# EasyEDA Pro project Generic_Robot_Controller_ver1.epro

# Schematic Schematic1_1

## Sheets
1 Block Diagram: Board Name: Board1_1; Create Date: 2024-12-06; Page Name: Block Diagram; Project Name: Generic_Robot_Controller; Schematic Name: Schematic1_1; Update Date: 2024-12-05; Company: EasyEDA.com; Drawn: EasyEDA; Page Size: A4; Part Number: JLCPCB-002; Reviewed: EasyEDA; Version: V0.1
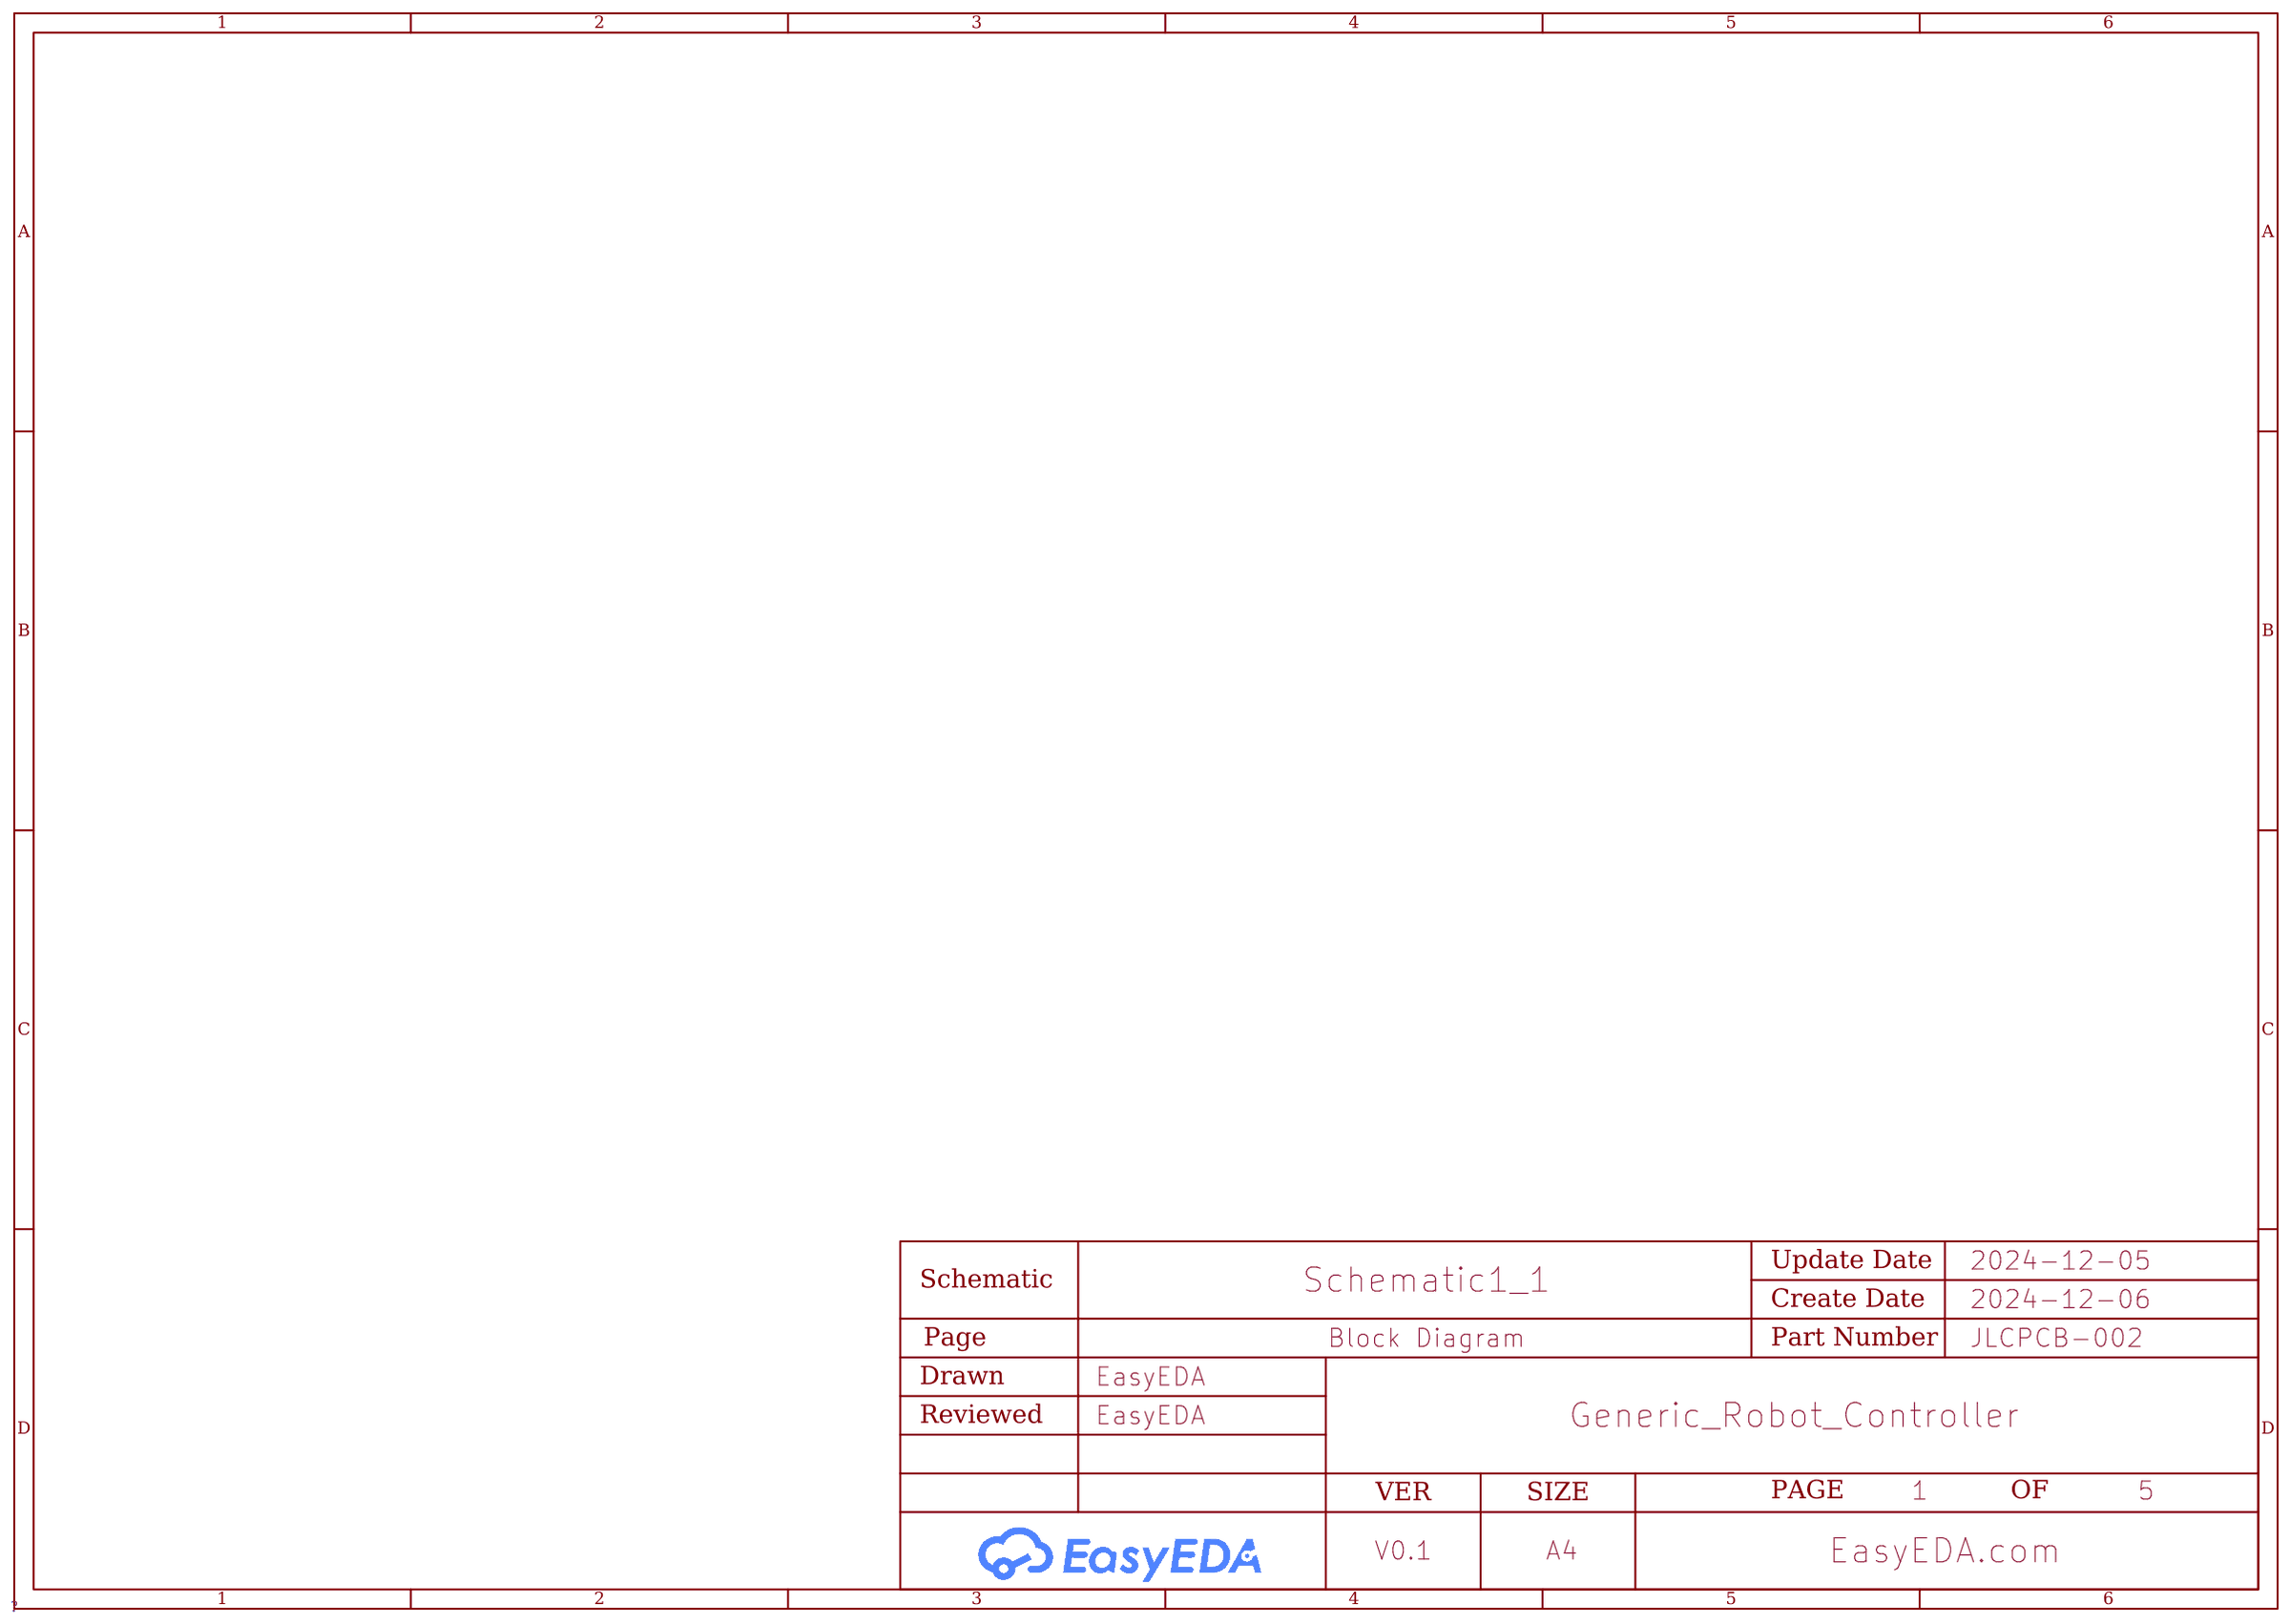
[diagram p0: Block Diagram]
2 MCU Connections: Create Date: 2024-12-05; Page Name: MCU Connections; Update Date: 2024-12-06
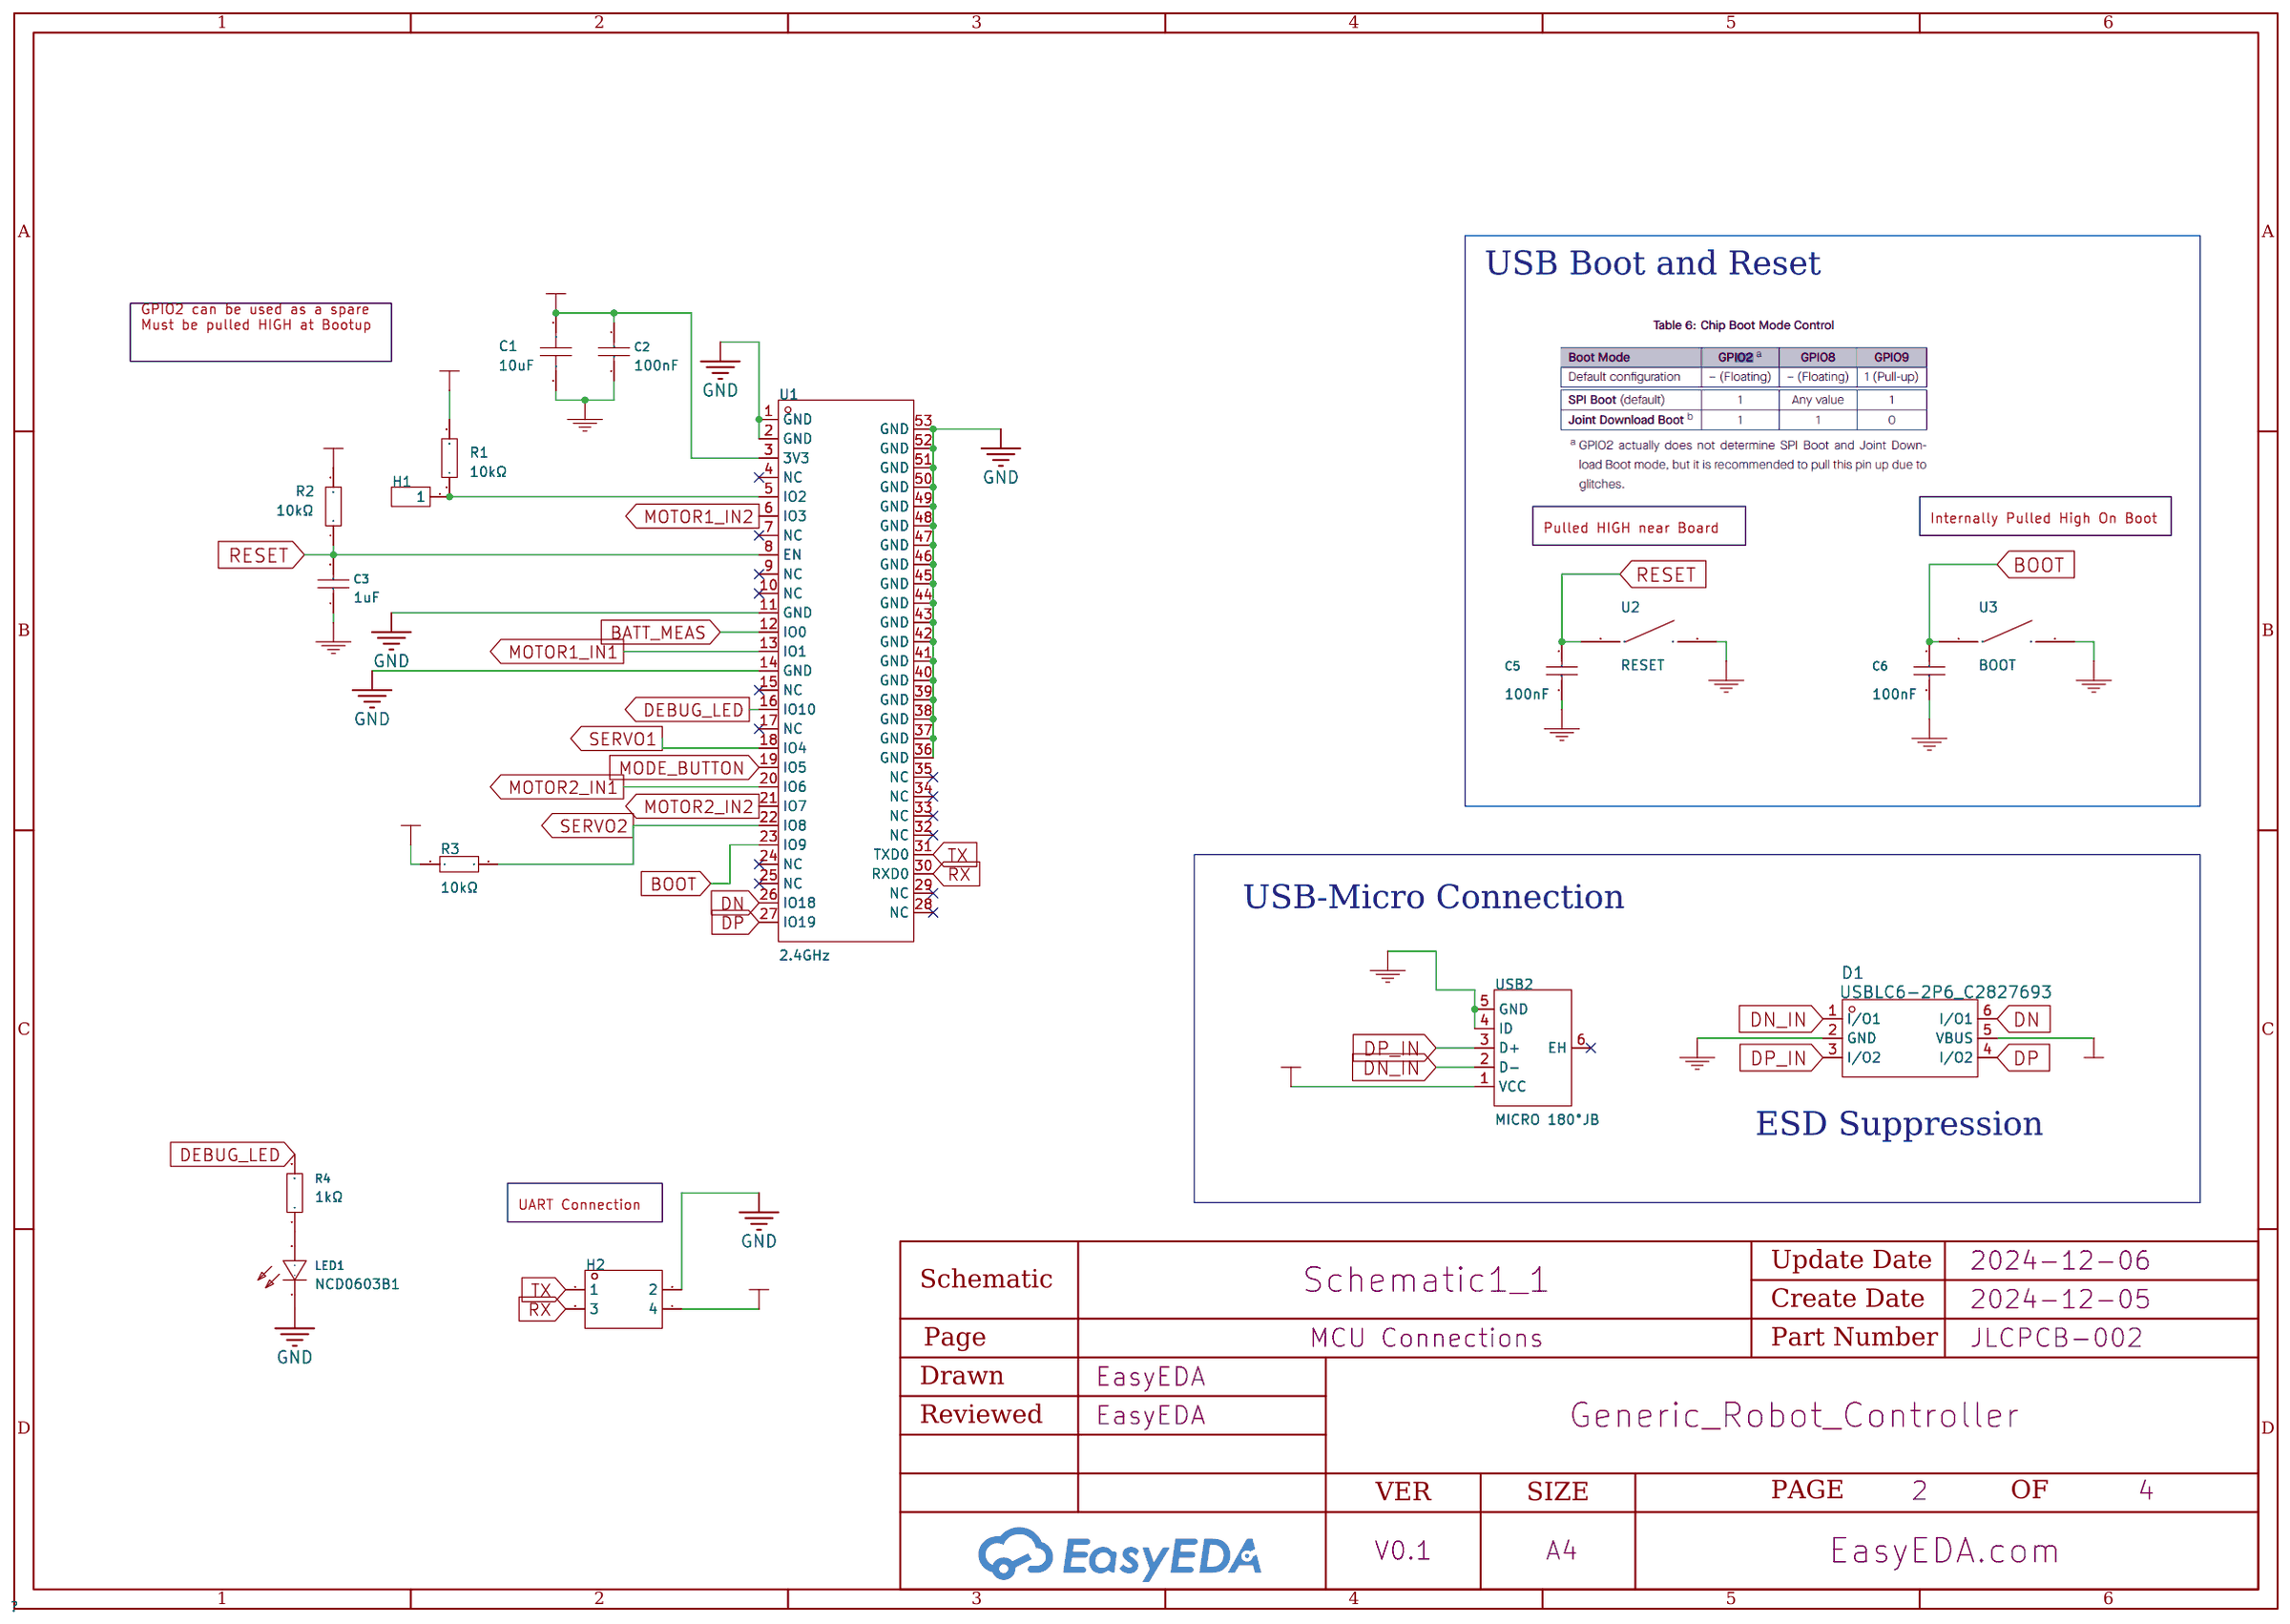
[diagram p1: MCU Connections]
3 Peripherals: Create Date: 2024-12-05; Page Name: Peripherals; Update Date: 2024-12-06
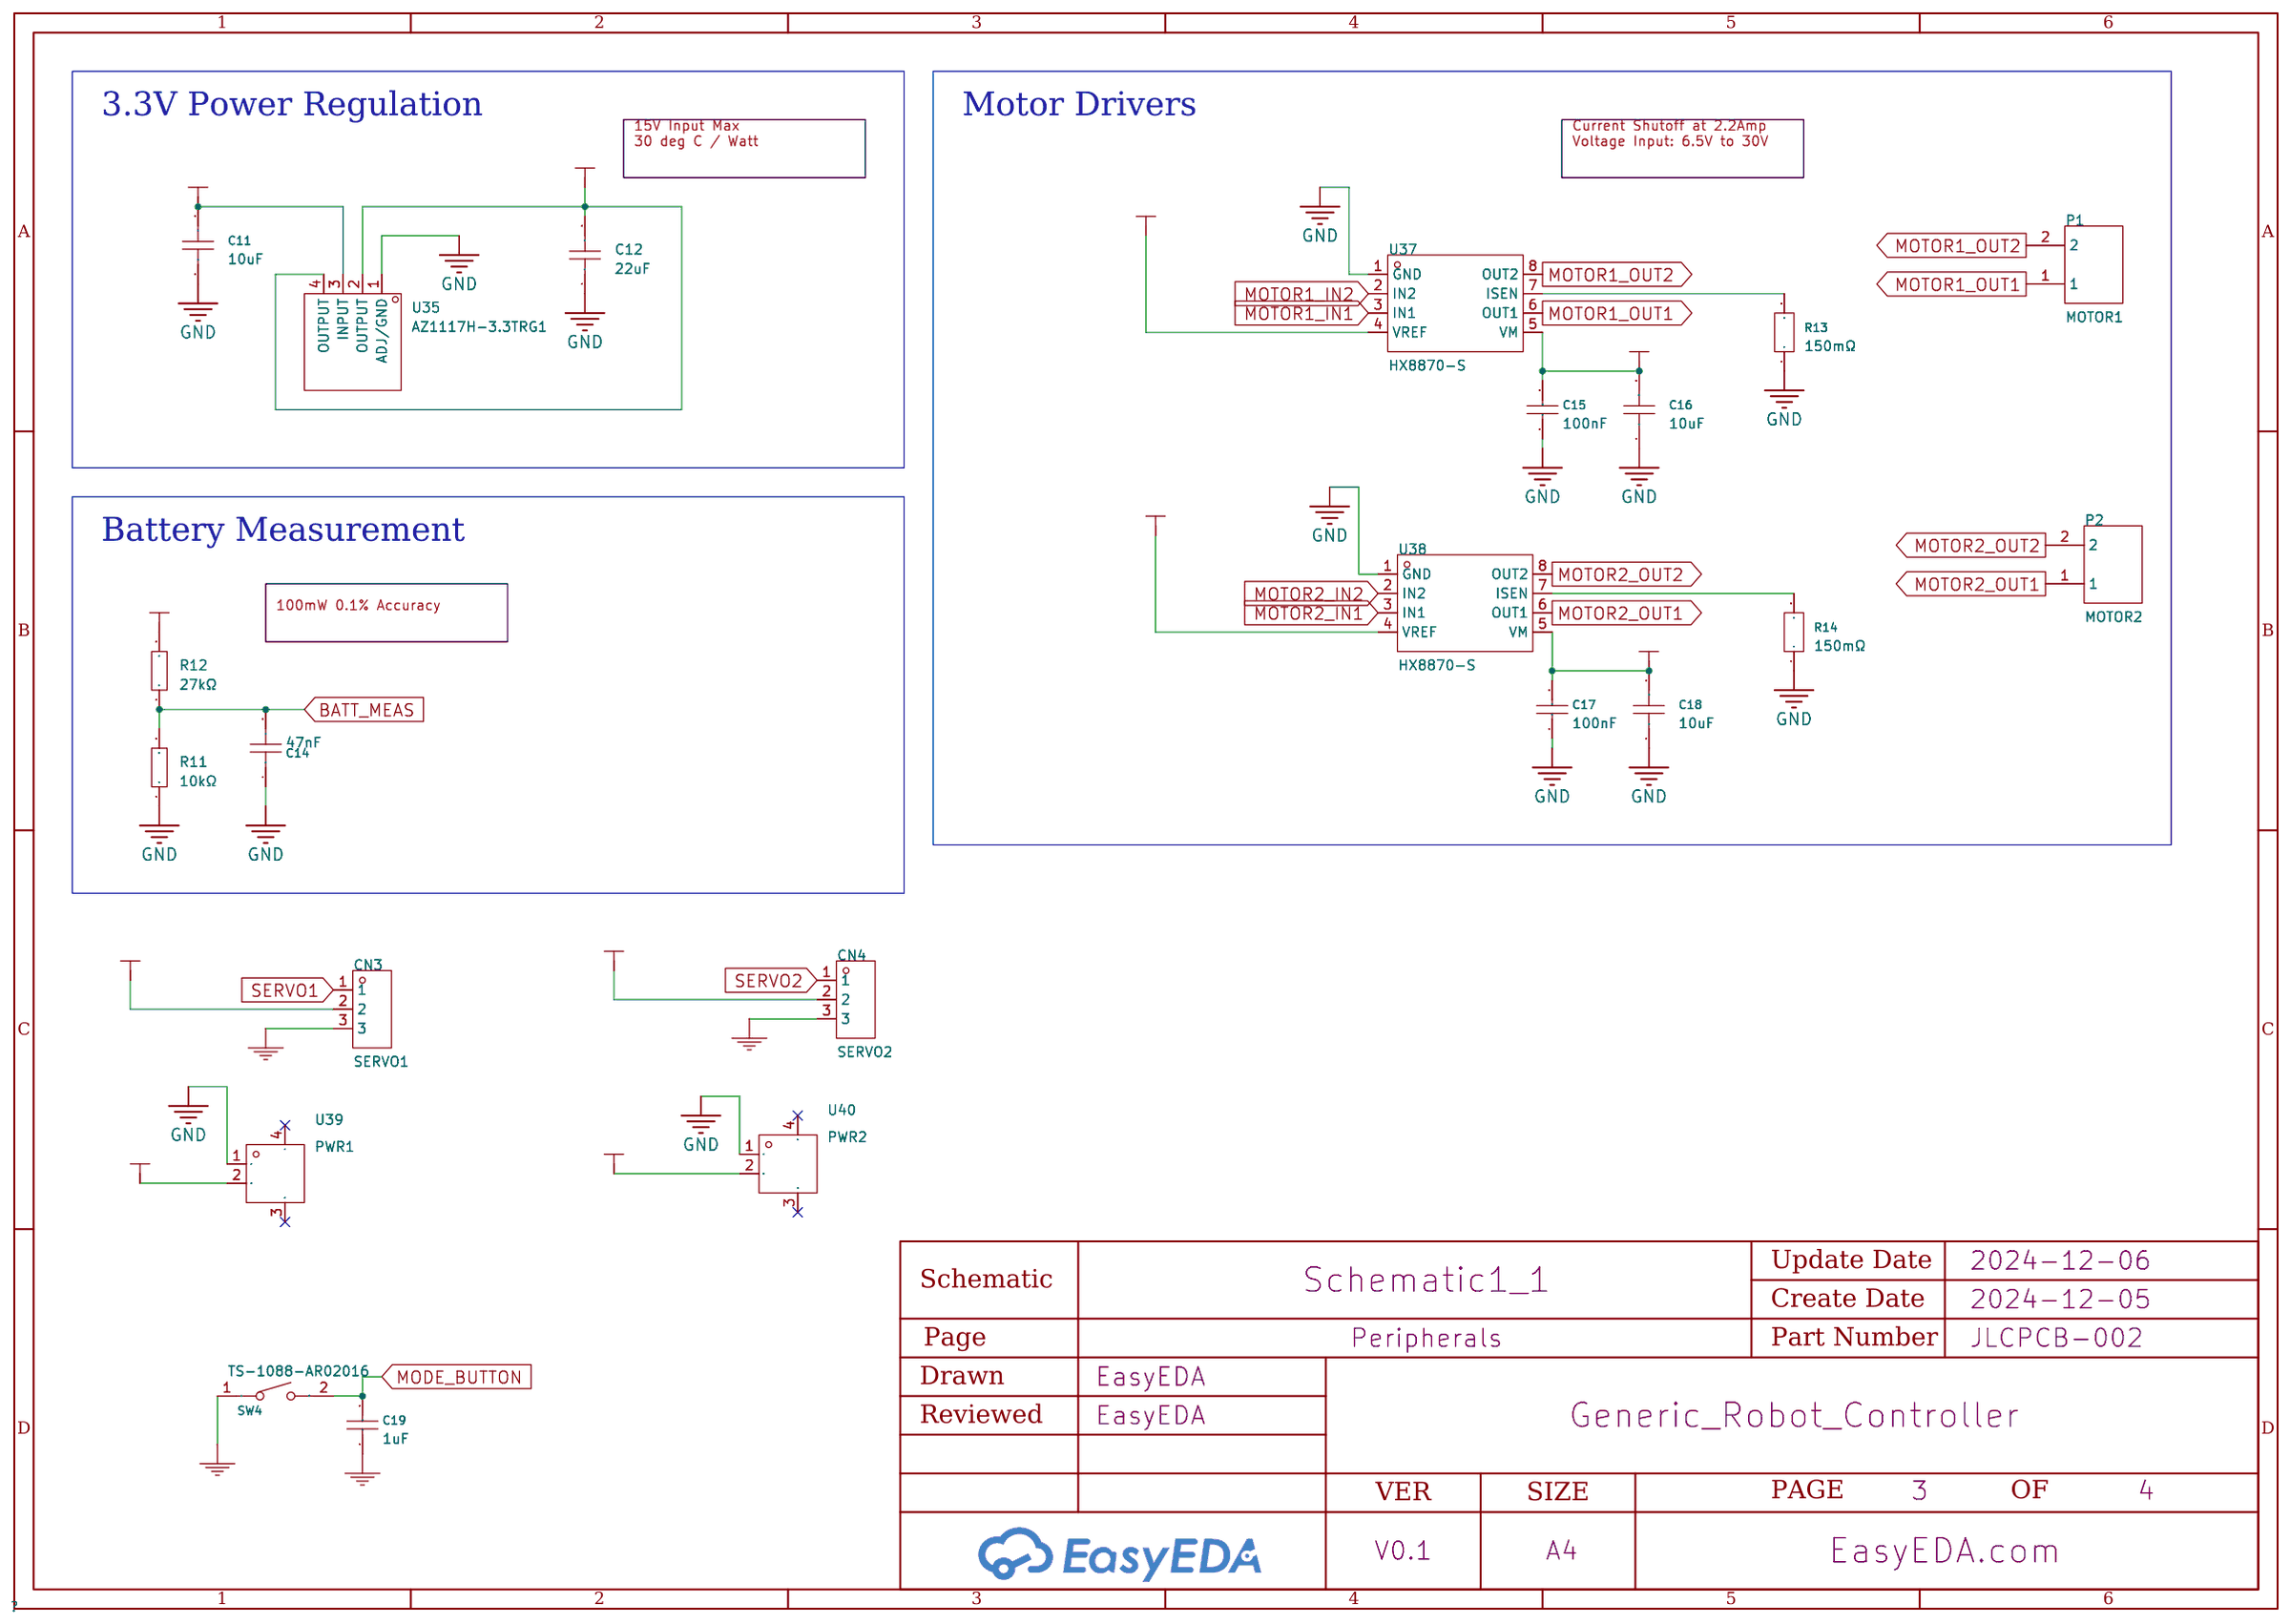
[diagram p2: Peripherals]
4 Power Input and Protection: Page Name: Power Input and Protection; Update Date: 2024-12-06
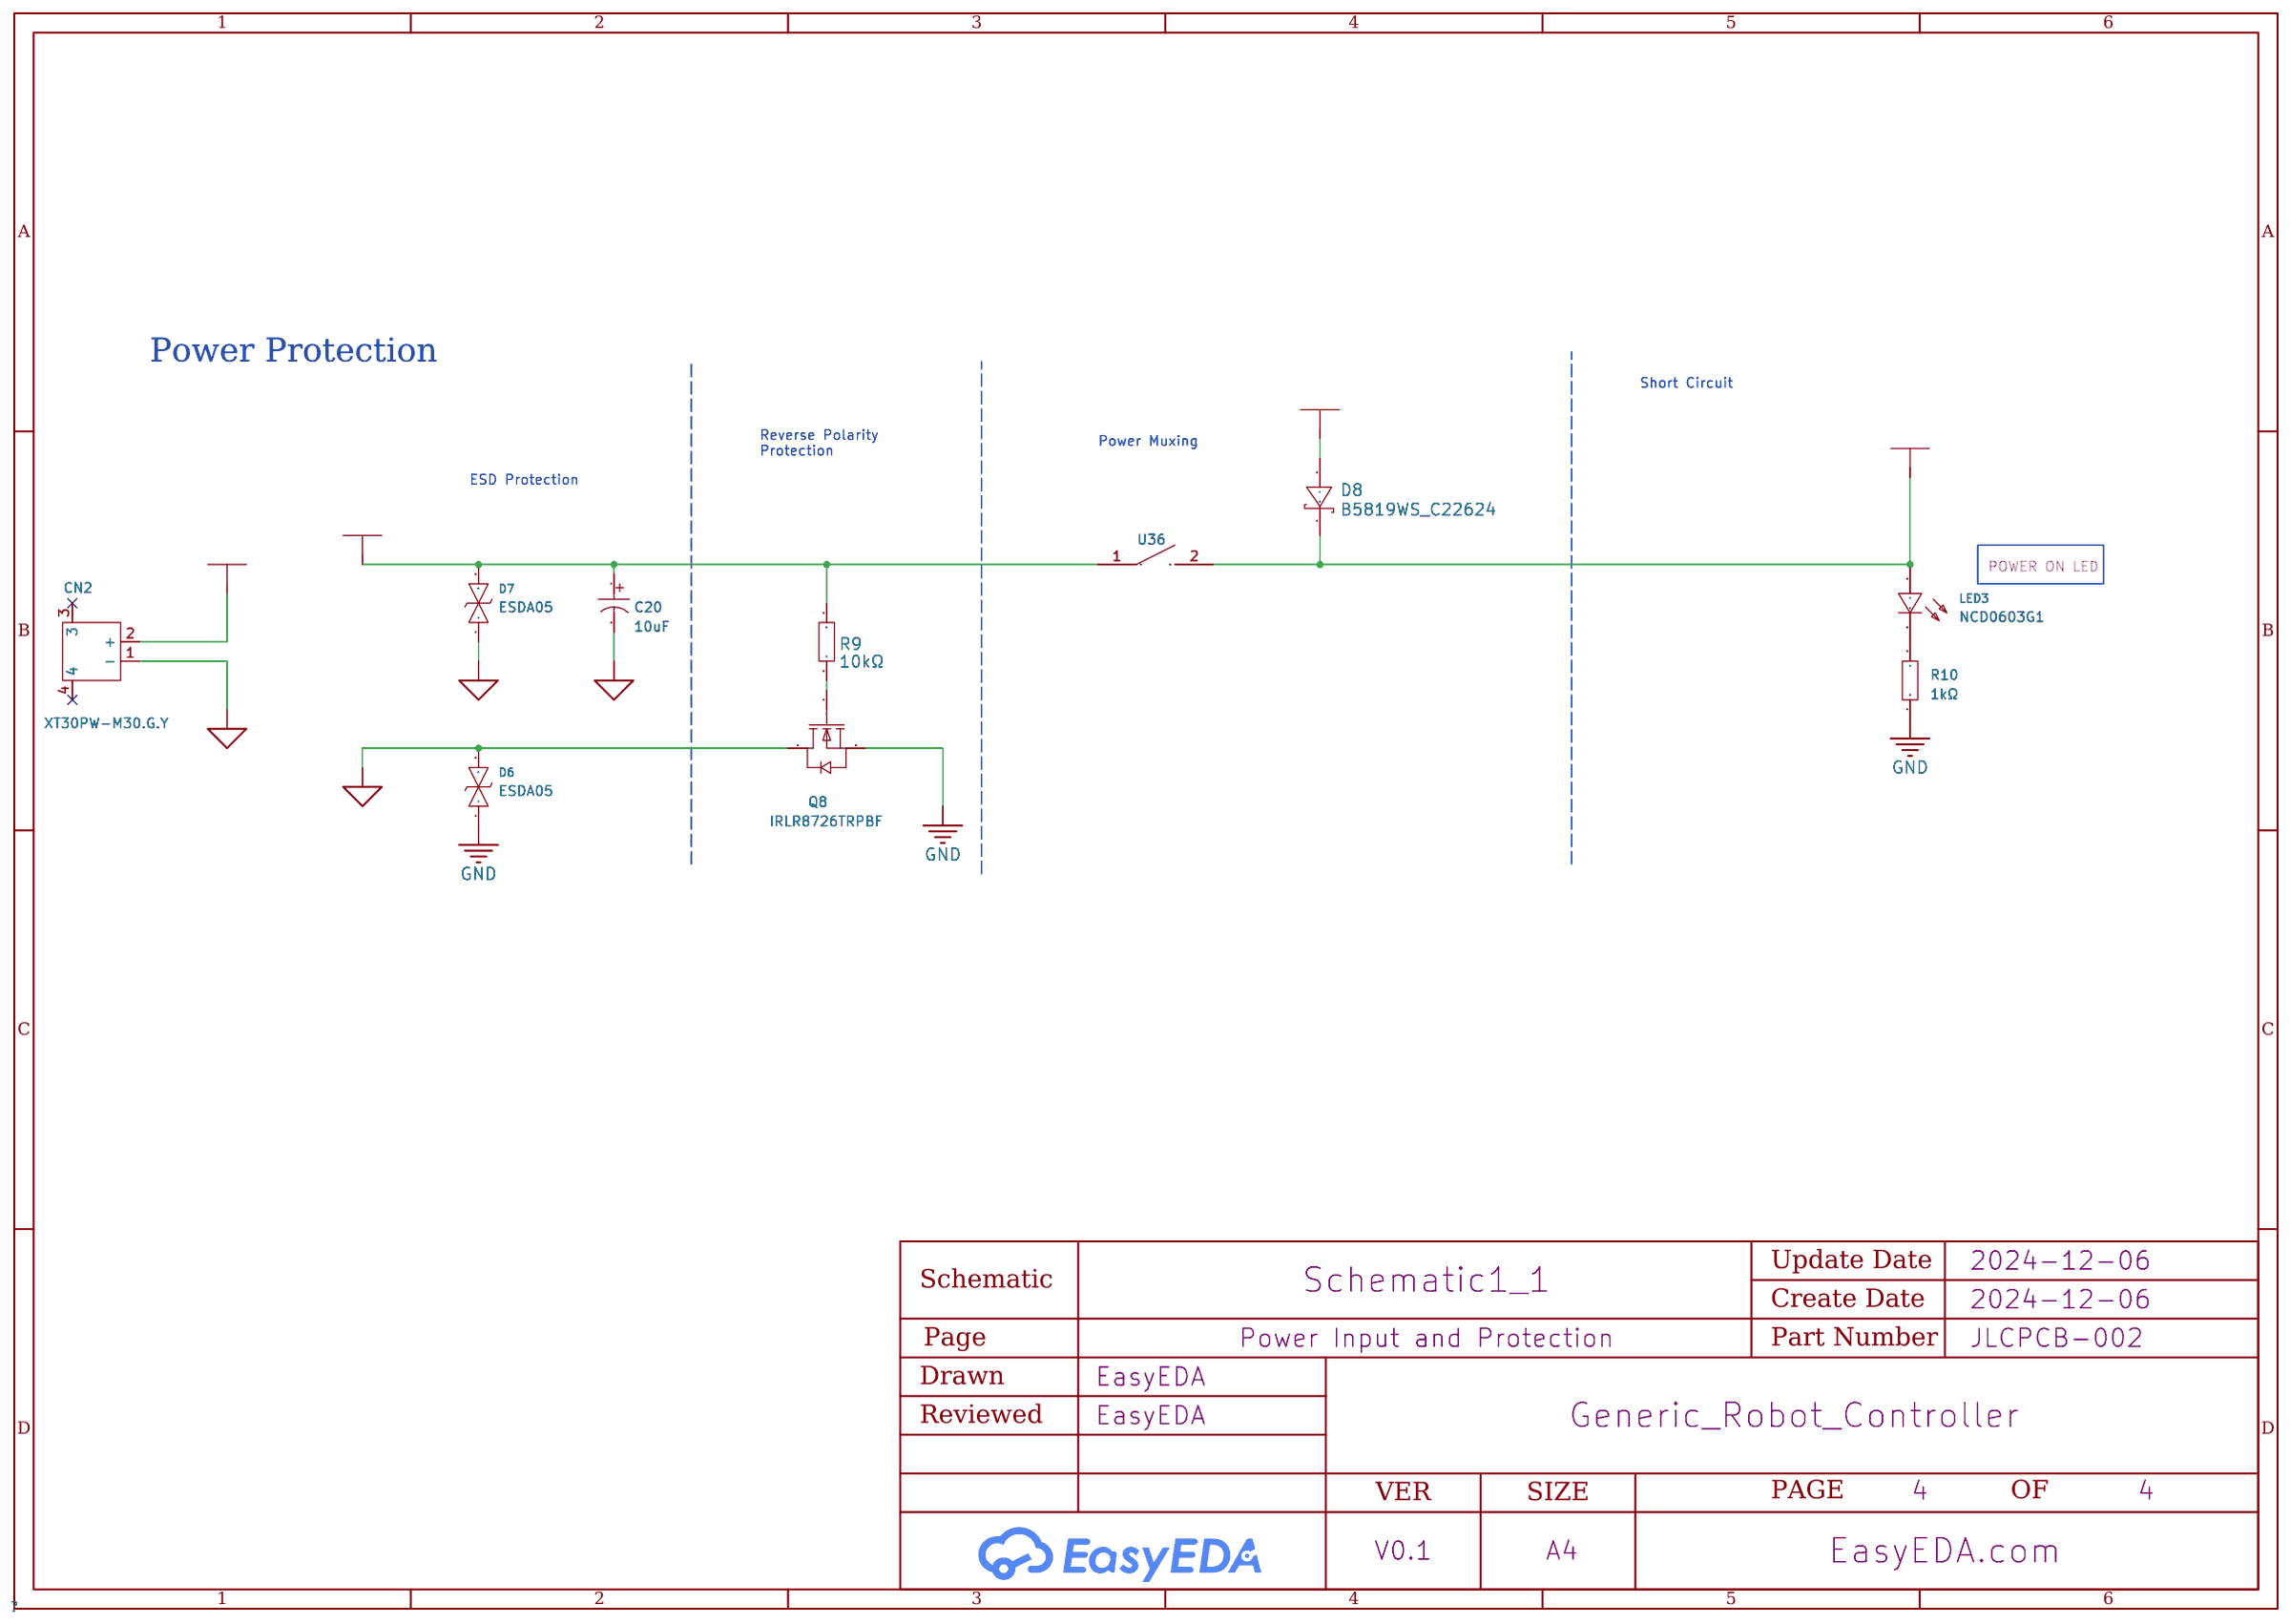
[diagram p3: Power Input and Protection]

## Parts
sheet MCU Connections
C1  10uF  [C0402]
C2  100nF  [C0402]
C3  1uF  [C0402]
C5  100nF  [C0402]
C6  100nF  [C0402]
D1  USBLC6-2P6_C2827693  [SOT-666-6_L1.6-W1.2-P0.50-LS1.6-BL]
H1  -  [HDR-TH_1P-V-M_XKB_X4611WV-01I-C28D40]  (no BOM)
H2  -  [HDR-TH_4P-P2.54-V-F-R2-C2-S2.54]  (no BOM)
LED1  NCD0603B1  [LED0603-RD]
R1  10kΩ  [R0402]
R2  10kΩ  [R0402]
R3  10kΩ  [R0402]
R4  1kΩ  [R0402]
U1  2.4GHz  [WIFIM-SMD_ESP32-C3-MINI-1]
U2  RESET  [SW-SMD_4P-L3.0-W2.0-P0.85-LS3.5]
U3  BOOT  [SW-SMD_4P-L3.0-W2.0-P0.85-LS3.5]
USB2  MICRO 180°JB  [MINI-USB-SMD_U255-051N-4BH70-XS]
sheet Peripherals
C11  10uF  [C0603]
C12  22uF  [C0402]
C14  47nF  [C0402]
C15  100nF  [C0402]
C16  10uF  [C0603]
C17  100nF  [C0402]
C18  10uF  [C0603]
C19  1uF  [C0402]
CN3  SERVO1  [CONN-TH_3P-P2.00_PH-3AK]
CN4  SERVO2  [CONN-TH_3P-P2.00_PH-3AK]
P1  MOTOR1  [CONN-TH_2P-P2.00_PH-2A_C2319]
P2  MOTOR2  [CONN-TH_2P-P2.00_PH-2A_C2319]
R11  10kΩ  [R0603]
R12  27kΩ  [R0603]
R13  150mΩ  [RES-SMD_L6.4-W3.2-1]
R14  150mΩ  [RES-SMD_L6.4-W3.2-1]
SW4  TS-1088-AR02016  [SW-SMD_L3.9-W3.0-P4.45]
U35  AZ1117H-3.3TRG1  [SOT-223-3_L6.5-W3.4-P2.30-LS7.0-BR]
U37  HX8870-S  [SOIC-8_L4.9-W3.9-P1.27-LS6.0-BL]
U38  HX8870-S  [SOIC-8_L4.9-W3.9-P1.27-LS6.0-BL]
U39  PWR1  [CONN-TH_XT30PW-F-1]
U40  PWR2  [CONN-TH_XT30PW-F-1]
sheet Power Input and Protection
C20  10uF  [CAP-SMD_BD4.0-L4.3-W4.3-FD]
CN2  XT30PW-M30.G.Y  [CONN-TH_XT30PW-M]
D6  ESDA05  [D0603-BI]
D7  ESDA05  [D0603-BI]
D8  B5819WS_C22624  [SOD-323_L1.8-W1.3-LS2.5-RD]
LED3  NCD0603G1  [LED0603-RD]
Q8  IRLR8726TRPBF  [TO-252-2_L6.6-W6.1-P4.58-LS9.9-TL]
R9  10kΩ  [R0603]
R10  1kΩ  [R0603]
U36  -  [screw_switch]

## Library data of the parts
C1 = CL05A106MP5NUNC_C315248: Capacitance: Tolerance:±20% Tolerance:±20% Voltage Rated: Temperature Coefficient:; LCSC Part Name: 10uF ±20% 10V; Supplier Part: C315248; Manufacturer: SAMSUNG(三星); Manufacturer Part: CL05A106MP5NUNC; Supplier Footprint: 0402; JLCPCB Part Class: Extended Part; Datasheet: https://atta.szlcsc.com/upload/public/pdf/source/20231220/1EF805BAE1520675928CC4638D279E74.pdf; Supplier: LCSC; Tolerance: ±20%
C2 C5 C6 C15 C17 = CL05B104KO5NNNC: Capacitance: Tolerance:±10% Tolerance:±10% Voltage Rated: Temperature Coefficient:; LCSC Part Name: 100nF ±10% 16V; Supplier Part: C1525; Manufacturer: SAMSUNG(三星); Supplier Footprint: 0402; JLCPCB Part Class: Basic Part; Datasheet: https://atta.szlcsc.com/upload/public/pdf/source/20160218/1457707763339.pdf; Supplier: LCSC; Tolerance: ±10%
C3 C19 = CL05A105KO5NNNC: Capacitance: Tolerance:±10% Tolerance:±10% Voltage Rated: Temperature Coefficient:; LCSC Part Name: 1uF ±10% 16V; Supplier Part: C29266; Manufacturer: SAMSUNG(三星); Supplier Footprint: 0402; JLCPCB Part Class: Extended Part; Datasheet: https://atta.szlcsc.com/upload/public/pdf/source/20160218/1457707763339.pdf; Supplier: LCSC; Tolerance: ±10%
D1 = USBLC6-2P6_C2827693: Supplier: LCSC; Supplier Part: C2827693; Manufacturer: TECH PUBLIC(台舟); Manufacturer Part: USBLC6-2P6; JLCPCB Part Class: Extended Part
H1 = HDR-M_2.54_1x1P: Supplier Footprint: Through
H2 = HDR-F-2.54_2x2: Supplier Footprint: Through
LED1 = NCD0603B1: Emitted Color:blue; LCSC Part Name: 蓝灯; Supplier Part: C84266; Manufacturer: 国星光电; Supplier Footprint: 0603; JLCPCB Part Class: Extended Part; Datasheet: https://atta.szlcsc.com/upload/public/pdf/source/20200820/C84266_6A3CDBEFA72C6CAD68EDA53474ADAE6C.pdf; Supplier: LCSC; Emitted Color: blue
R1-R3 = RC0402FR-0710KL: Type:Thick Film Resistors Resistance: Tolerance:±1% Tolerance:±1% Power(Watts): Overload Voltage (Max): Temperature Coefficient:±100ppm/℃ Temperature Coefficient:±100ppm/℃ Operating Temperature Range:-55℃~+155℃ Operating Temperature Range:-55℃~+155℃; LCSC Part Name: 厚膜电阻 10kΩ ±1% 62.5mW; Supplier Part: C60490; Manufacturer: YAGEO(国巨); Supplier Footprint: 0402; JLCPCB Part Class: Extended Part; Datasheet: https://atta.szlcsc.com/upload/public/pdf/source/20170925/C131467_1506321478108990263.pdf; Supplier: LCSC; Type: Thick Film Resistors; Tolerance: ±1%; Temperature Coefficient: ±100ppm/℃; Operating Temperature Range: -55℃~+155℃
R4 = 0402WGF1001TCE: Type:Thick Film Resistors Resistance:1kΩ Tolerance:±1% Tolerance:±1% Power(Watts): Overload Voltage (Max): Temperature Coefficient:±100ppm/℃ Temperature Coefficient:±100ppm/℃ Operating Temperature Range:-55℃~+155℃ Operating Temperature Range:-55℃~+155℃; LCSC Part Name: 1kΩ ±1% 62.5mW 厚膜电阻; Supplier Part: C11702; Manufacturer: UNI-ROYAL(厚声); Supplier Footprint: 0402; JLCPCB Part Class: Basic Part; Datasheet: https://atta.szlcsc.com/upload/public/pdf/source/20200306/C422600_1E6D84923E4A46A82E41ADD87F860B5C.pdf; Supplier: LCSC; Type: Thick Film Resistors; Tolerance: ±1%; Temperature Coefficient: ±100ppm/℃; Operating Temperature Range: -55℃~+155℃
U1 = ESP32-C3-MINI-1-H4_C2934569: Core Processor:- Wireless Standard:- Support Interface:SPI Frequency:2.4GHz Antenna Type:板载PCBAntenna Output Power:20.5dBm Output Power:20.5dBm Operating Voltage:3.3V Operating Voltage:3.3V Receive  Current:- Send  Current:- Sensitivity:-96dBm Sensitivity; LCSC Part Name: ESP32-C3-MINI-1-H4; Supplier Part: C2934569; Manufacturer: ESPRESSIF(乐鑫); Manufacturer Part: ESP32-C3-MINI-1-H4; Supplier Footprint: SMD,13.2x16.6mm; JLCPCB Part Class: Extended Part; Datasheet: https://atta.szlcsc.com/upload/public/pdf/source/20211222/4A6E563D9536B67D492463D36DD57C1D.pdf; Supplier: LCSC; Support Interface: SPI; Antenna Type: 板载PCBAntenna; Output Power: 20.5dBm; Operating Voltage: 3.3V; Sensitivity: -96dBm; Operating Temperature: -40℃~+85℃
U2 U3 = TS2306A 240gf MSM 9_1: Circuit:SPST Actuator Style:Round Button Operating Force:240gf Mounting Style:Brick nogging Switch Length:3mm Switch Width:2mm Switch Height:0.6mm Strike Gundam:不带 Contact Current:20mA Voltage Rating (DC):15V Insulation Resistance:50MΩ Actuator/Cap Color:; LCSC Part Name: 3*2*0.6mm 立贴 轻触开关; Supplier Part: C2976675; Manufacturer: SHOU HAN(首韩); Manufacturer Part: TS2306A 240gf MSM 9; Supplier Footprint: SMD; JLCPCB Part Class: Extended Part; Datasheet: https://atta.szlcsc.com/upload/public/pdf/source/20220218/7BAFCACACDA2A9DF2837C38C1234C9E9.pdf; Supplier: LCSC; Circuit: SPST; Actuator Style: Round Button; Operating Force: 240gf; Mounting Style: Brick nogging; Switch Length: 3mm; Switch Width: 2mm; Switch Height: 0.6mm; Strike Gundam: 不带; Contact Current: 20mA; Voltage Rating (DC): 15V; Insulation Resistance: 50MΩ; Actuator/Cap Color: Black; Pin Style: SMDSplicing; Mechanical Life: 50万次; Operating Temperature: -40℃~+85℃
USB2 = MICRO 180°JB: Connector Type:Micro-B Standard:USB 2.0 Gender:Female Mounting Style:Direct Insert Number of Contacts:5P Number of Ports:1 Current Rating - Power (Max):1A Operating Temperature Range:-30℃~+80℃ Operating Temperature Range:-30℃~+80℃ Connect-Disconnect Life:; LCSC Part Name: Micro-B 母 直插; Supplier Part: C456007; Manufacturer: SHOU HAN(首韩); Supplier Footprint: 插件; JLCPCB Part Class: Extended Part; Datasheet: https://atta.szlcsc.com/upload/public/pdf/source/20191113/C456007_CA924046CF509CAB4DE8B25D1662CC7A.pdf; Supplier: LCSC; Connector Type: Micro-B; Standard: USB 2.0; Gender: Female; Mounting Style: Direct Insert; Number of Contacts: 5P; Number of Ports: 1; Current Rating - Power (Max): 1A; Operating Temperature Range: -30℃~+80℃; Connect-Disconnect Life: 3000 times; Core Colour: Black
C11 C16 C18 = CL10A106MA8NRNC: Capacitance: Tolerance:±20% Tolerance:±20% Voltage Rated: Temperature Coefficient:; LCSC Part Name: 10uF ±20% 25V; Supplier Part: C96446; Manufacturer: SAMSUNG(三星); Supplier Footprint: 0603; JLCPCB Part Class: Basic Part; Datasheet: https://atta.szlcsc.com/upload/public/pdf/source/20160218/1457707763339.pdf; Supplier: LCSC; Tolerance: ±20%
C12 = GRM158R61A226ME15D: Capacitance: Tolerance:±20% Tolerance:±20% Voltage Rated: Temperature Coefficient:; LCSC Part Name: 22uF ±20% 10V; Supplier Part: C3845593; Manufacturer: muRata(村田); Supplier Footprint: 0402; JLCPCB Part Class: Extended Part; Datasheet: https://atta.szlcsc.com/upload/public/pdf/source/20230811/016E9304DA64D47AB1EFBD6C89B0D146.pdf; Supplier: LCSC; Tolerance: ±20%
C14 = CC0402KRX7R9BB473: Capacitance: Tolerance:±10% Tolerance:±10% Voltage Rated: Temperature Coefficient:; LCSC Part Name: 47nF ±10% 50V; Supplier Part: C272875; Manufacturer: YAGEO(国巨); Supplier Footprint: 0402; JLCPCB Part Class: Extended Part; Datasheet: https://atta.szlcsc.com/upload/public/pdf/source/20181008/C309510_22F155564471FAF6A489F7D68F34234E.pdf; Supplier: LCSC; Tolerance: ±10%
CN3 CN4 = HC-PH-3A-B-K-10: Pins Structure:1x3P Pitch:2mm Mounting Style:Direct Insert Reference Series:PH Number of Pins:3P Number of Rows:1 Number of PINs Per Row:3 Row Spacing:- Current Rating (Max):3A Contact Material:Brass Contact Plating:Tin Operating Temperature Range:-25℃~+8; LCSC Part Name: 1x3P 间距:2mm 直插 系列:PH 黑色; Supplier Part: C7502642; Manufacturer: HCTL(华灿天禄); Supplier Footprint: 插件,P=2.00mm; JLCPCB Part Class: Extended Part; Datasheet: https://atta.szlcsc.com/upload/public/pdf/source/20240830/CA30958A987724872D0DC89B5B4363A6.pdf; Supplier: LCSC; Pins Structure: 1x3P; Pitch: 2mm; Mounting Style: Direct Insert; Reference Series: PH; Number of Pins: 3P; Number of Rows: 1; Number of PINs Per Row: 3; Current Rating (Max): 3A; Contact Material: Brass; Contact Plating: Tin; Operating Temperature Range: -25℃~+85℃; Rated Voltage (Max): 250V; Plastic Material: PA66; Flame Retardant Rating: UL94V-0; Supplementary Features: K-leg punch; Colour: Black; Z-Height of the Board: 6mm; X-Length of Bottom Edge on Board (Spacing Line): 8mm; Y-Width of Bottom Edge on Board: 4.7mm
P1 P2 = PH-2A_C2319: Pins Structure:1x2P Pitch:2mm Mounting Style:- Reference Series:PH Number of Pins:2P Number of Rows:1 Number of PINs Per Row:2 Row Spacing:- Contact Material:-; LCSC Part Name: 系列:PH 间距:2mm 1x2P; Supplier Part: C2319; Manufacturer: BOOMELE(博穆精密); Manufacturer Part: PH-2A; Supplier Footprint: 插件,P=2mm; JLCPCB Part Class: Extended Part; Datasheet: https://atta.szlcsc.com/upload/public/pdf/source/20151208/1457707613620.pdf; Supplier: LCSC; Pins Structure: 1x2P; Pitch: 2mm; Reference Series: PH; Number of Pins: 2P; Number of Rows: 1; Number of PINs Per Row: 2
R11 = RT0603BRD0710KL: Type:Thin Film Resistor Resistance: Tolerance:±0.1% Tolerance:±0.1% Power(Watts): Overload Voltage (Max): Temperature Coefficient:±25ppm/℃ Temperature Coefficient:±25ppm/℃ Operating Temperature Range:-55℃~+155℃ Operating Temperature Range:-55℃~+155℃; LCSC Part Name: 薄膜电阻 10kΩ ±0.1% 100mW; Supplier Part: C95204; Manufacturer: YAGEO(国巨); Supplier Footprint: 0603; JLCPCB Part Class: Extended Part; Datasheet: https://atta.szlcsc.com/upload/public/pdf/source/20170217/1487301593756.pdf; Supplier: LCSC; Type: Thin Film Resistor; Tolerance: ±0.1%; Temperature Coefficient: ±25ppm/℃; Operating Temperature Range: -55℃~+155℃
R12 = RT0603BRD0727KL: Type:Thin Film Resistor Resistance: Tolerance:±0.1% Tolerance:±0.1% Power(Watts): Overload Voltage (Max): Temperature Coefficient:±25ppm/℃ Temperature Coefficient:±25ppm/℃ Operating Temperature Range:-55℃~+155℃ Operating Temperature Range:-55℃~+155℃; LCSC Part Name: 薄膜电阻 27kΩ ±0.1% 100mW; Supplier Part: C309651; Manufacturer: YAGEO(国巨); Supplier Footprint: 0603; JLCPCB Part Class: Extended Part; Datasheet: https://atta.szlcsc.com/upload/public/pdf/source/20181009/C309664_C7CEF5A7F4D0541F96EF5E54D941D229.pdf; Supplier: LCSC; Type: Thin Film Resistor; Tolerance: ±0.1%; Temperature Coefficient: ±25ppm/℃; Operating Temperature Range: -55℃~+155℃
R13 R14 = HoJLR2512-3W-150mR-1%: Type:Current Sensing Resistors Resistance:150mΩ Tolerance:±1% Tolerance:±1% Power(Watts): Mounting Sytle:Surface Mount; LCSC Part Name: 150mΩ ±1% 3W; Supplier Part: C2903485; Manufacturer: Milliohm(毫欧); Supplier Footprint: 2512; JLCPCB Part Class: Extended Part; Datasheet: https://atta.szlcsc.com/upload/public/pdf/source/20211009/7525CABAB363C979E942C1DD41F1FEF0.pdf; Supplier: LCSC; Type: Current Sensing Resistors; Tolerance: ±1%; Mounting Sytle: Surface Mount
SW4 = TS-1088-AR02016: Circuit:SPST Actuator Style:Round Button Operating Force:160gf Mounting Style:Brick nogging Switch Length:4mm Switch Width:3mm Switch Height:2mm Strike Gundam:不带 Contact Current:50mA Voltage Rating (DC):12V Insulation Resistance:100MΩ Actuator/Cap Color:B; LCSC Part Name: 4*3*2mm 立贴 轻触开关; Supplier Part: C720477; Manufacturer: XUNPU(讯普); Supplier Footprint: SMD; JLCPCB Part Class: Extended Part; Datasheet: https://atta.szlcsc.com/upload/public/pdf/source/20200810/C720475_60D09DD6C54279ADDB2DC25100F1CC11.pdf; Supplier: LCSC; Circuit: SPST; Actuator Style: Round Button; Operating Force: 160gf; Mounting Style: Brick nogging; Switch Length: 4mm; Switch Width: 3mm; Switch Height: 2mm; Strike Gundam: 不带; Contact Current: 50mA; Voltage Rating (DC): 12V; Insulation Resistance: 100MΩ; Actuator/Cap Color: Black; Pin Style: SMDSplicing; Mechanical Life: 10万次; Operating Temperature: -30℃~+80℃
U35 = AZ1117H-3.3TRG1: Output Type:Fixed Maximum Input Voltage:15V Output Voltage:3.3V Output Voltage:3.3V Output Current:1A Power Supply Rejection Ratio (PSRR):75dB@(120Hz) Dropout Voltage:1.3V@(0.8A) standby current:10mA Noise:- Feature:Overcurrent Protection(OCP)；Thermal Pro; LCSC Part Name: 输入15V 输出3.3V 1A; Supplier Part: C110474; Manufacturer: DIODES(美台); Supplier Footprint: SOT-223-3; JLCPCB Part Class: Extended Part; Datasheet: https://atta.szlcsc.com/upload/public/pdf/source/20181205/C110475_93E0B5F7267F457583F8503C8159CAD9.pdf; Supplier: LCSC; Output Type: Fixed; Maximum Input Voltage: 15V; Output Voltage: 3.3V; Output Current: 1A; Power Supply Rejection Ratio (PSRR): 75dB@(120Hz); Dropout Voltage: 1.3V@(0.8A); standby current: 10mA; Feature: Overcurrent Protection(OCP)；Thermal Protection(TSD); Operating Temperature: -40℃~+125℃@(Tj); Output Polarity: Positive electrode; Number of Outputs: 1
U37 U38 = HX8870-S: Supplier Part: C22392191; Manufacturer: ZHHXDZ(海芯电子); Supplier Footprint: SOP-8; JLCPCB Part Class: Extended Part; Datasheet: https://atta.szlcsc.com/upload/public/pdf/source/20240507/22D8E4D8DB91557E9E580865BB9577BE.pdf; Supplier: LCSC
U39 U40 = XT30PW-F20.G.Y: Power:- Output:- Input:- Size:- Interface:- Type:- Colour:- MaximumCurrent:- Type:航模插头 RatedVoltage:- Type1:- NumberOfUSBHoles:- InterfaceType:母头 MetalMaterial:- InsulationMaterial:- RatedCurrent:- RecommendedWireGauge:- FlameRetardantGrade:- contact resi; LCSC Part Name: AMASS(艾迈斯)电源连接器 母头 XT30PW-F; Supplier Part: C2913282; Manufacturer: AMASS(艾迈斯); JLCPCB Part Class: Extended Part; Datasheet: https://atta.szlcsc.com/upload/public/pdf/source/20231218/06CFCF98887A9A87638B0856A725C8FD.pdf; Supplier: LCSC; Type: 航模插头; InterfaceType: 母头
C20 = RVT1V100M0405_C72485: Capacitance: Tolerance:±20% Tolerance:±20% Rated Voltage: Ripple Current:15mA@120Hz Equivalent Series Resistance(ESR):- φD: L: Lifetime @ Temp:2000hrs@105℃ Operating Temperature:-40℃~+105℃ Operating Temperature:-40℃~+105℃; LCSC Part Name: 10uF ±20% 35V; Supplier Part: C72485; Manufacturer: ROQANG(容强); Manufacturer Part: RVT1V100M0405; Supplier Footprint: SMD,D4xL5.4mm; JLCPCB Part Class: Extended Part; Datasheet: https://atta.szlcsc.com/upload/public/pdf/source/20170325/1490427950282.pdf; Supplier: LCSC; Tolerance: ±20%; Ripple Current: 15mA@120Hz; Lifetime @ Temp: 2000hrs@105℃; Operating Temperature: -40℃~+105℃
CN2 = XT30PW-M30.G.Y: Power:- Output:- Input:- Size:- Interface:- Type:- Colour:- MaximumCurrent:- Type:Aviation model plug RatedVoltage:DC 500V Type1:- NumberOfUSBHoles:- InterfaceType:Male head MetalMaterial:- InsulationMaterial:- RatedCurrent:15A RecommendedWireGauge:16/18/; LCSC Part Name: AMASS(艾迈斯)航模插头 卧式弯脚 XT30PW-M公头; Supplier Part: C431092; Manufacturer: AMASS(艾迈斯); JLCPCB Part Class: Extended Part; Datasheet: https://atta.szlcsc.com/upload/public/pdf/source/20220222/6A9F22F7850E25B33E1BE430ADF8560B.pdf; Supplier: LCSC; Type: Aviation model plug; RatedVoltage: DC 500V; InterfaceType: Male head; RatedCurrent: 15A; RecommendedWireGauge: 16/18/20AWG; contact resistance: 1.2mΩ; specifications: 2pin
D6 D7 = ESDA05: Supplier Part: C2836909; Manufacturer: Leiditech(雷卯电子); Supplier Footprint: 0603; JLCPCB Part Class: ExtendedPart; Datasheet: https://atta.szlcsc.com/upload/public/pdf/source/20210615/C2836909_242F3C6F6AD2D40985397C95B8188520.pdf; Supplier: LCSC
D8 = B5819WS_C22624: Supplier: LCSC; Manufacturer Part: B5819WS; Manufacturer: CJ(江苏长电/长晶); Supplier Part: C22624; JLCPCB Part Class: Extended Part; link: https://lcsc.com/eda_search?q=C22624&amp;%26type=1&amp;ref=editor
LED3 = NCD0603G1: Emitted Color:Emerald; LCSC Part Name: 翠绿0603翠绿正贴; Supplier Part: C84267; Manufacturer: 国星光电; Supplier Footprint: 0603; JLCPCB Part Class: ExtendedPart; Datasheet: https://atta.szlcsc.com/upload/public/pdf/source/20200820/C84267_04BA7703640BAC111D09F5EFB971FBF3.pdf; Supplier: LCSC; Emitted Color: Emerald
Q8 = IRLR8726TRPBF: Type:1 N-channel Drain Source Voltage (Vdss): Continuous Drain Current (Id): Drain Source On Resistance (RDS(on)@Vgs,Id):5.8mΩ@10V,25A Power Dissipation (Pd): Gate Threshold Voltage (Vgs(th)@Id):1.8V@50uA Total Gate Charge (Qg@Vgs):23nC Input Capacitance; LCSC Part Name: 1个N沟道 耐压:30V 电流:86A; Supplier Part: C81137; Manufacturer: Infineon(英飞凌); Supplier Footprint: TO-252-2(DPAK); JLCPCB Part Class: Extended Part; Datasheet: https://atta.szlcsc.com/upload/public/pdf/source/20170518/1495085732211.pdf; Supplier: LCSC; Type: 1 N-channel; Drain Source On Resistance (RDS(on)@Vgs,Id): 5.8mΩ@10V,25A; Gate Threshold Voltage (Vgs(th)@Id): 1.8V@50uA; Total Gate Charge (Qg@Vgs): 23nC; Input Capacitance (Ciss@Vds): 2.15nF; Reverse Transfer Capacitance (Crss@Vds): 205pF@15V; Operating Temperature: -55℃~+175℃
R9 = 10kΩ: Supplier: LCSC; Manufacturer: YAGEO(国巨); Manufacturer Part: RC0603FR-0710KL; Supplier Part: C98220; JLCPCB Part Class: Extended Part; link: https://lcsc.com/eda_search?q=C98220&amp;%26type=1&amp;ref=editor
R10 = 0603WAF1001T5E: Type:Thick Film Resistors Resistance: Tolerance:±1% Tolerance:±1% Power(Watts): Temperature Coefficient:±100ppm/℃ Temperature Coefficient:±100ppm/℃ Overload Voltage (Max): Operating Temperature Range:-55℃~+155℃ Operating Temperature Range:-55℃~+155℃; LCSC Part Name: 1kΩ±1%100mW; Supplier Part: C21190; Manufacturer: UNI-ROYAL(厚声); Supplier Footprint: 0603; JLCPCB Part Class: BasicPart; Datasheet: https://atta.szlcsc.com/upload/public/pdf/source/20200306/C422600_1E6D84923E4A46A82E41ADD87F860B5C.pdf; Supplier: LCSC; Type: ThickFilmResistors; Tolerance: ±1%; Temperature Coefficient: ±100ppm/℃; Operating Temperature Range: -55℃~+155℃
U36 = screw_switch

## Nets
3V3: C1.2 C2.2 C12.2 CN3.2 CN4.2 R1.2 R2.2 R3.1 U1.3(3V3) U35.2(OUTPUT) U35.4(OUTPUT) U37.4(VREF) U38.4(VREF)
GND: C1.1 C2.1 C3.1 C5.1 C6.1 C11.1 C12.1 C14.1 C15.1 C16.1 C17.1 C18.1 C19.1 CN3.3 CN4.3 D1.2(GND) D6.1 H2.2 LED1.1(-) Q8.3(S) R10.1 R11.1 R13.1 R14.1 SW4.1 U1.1(GND) U1.2(GND) U1.11(GND) U1.14(GND) U1.36(GND) U1.37(GND) U1.38(GND) U1.39(GND) U1.40(GND) U1.41(GND) U1.42(GND) U1.43(GND) U1.44(GND) U1.45(GND) U1.46(GND) U1.47(GND) U1.48(GND) U1.49(GND) U1.50(GND) U1.51(GND) U1.52(GND) U1.53(GND) U2.2 U3.2 U35.1(ADJ/GND) U37.1(GND) U38.1(GND) U39.1 U40.1 USB2.4(ID) USB2.5(GND)
BATT_GND: C20.2 CN2.1(-) D6.2 D7.1 Q8.2(D)
BATT_IN: C20.1 CN2.2(+) D7.2 R9.1 U36.1
BATT_MEAS: C14.2 R11.2 R12.1 U1.12(IO0)
BOOT: C6.2 U1.23(IO9) U3.1
DEBUG_LED: R4.2 U1.16(IO10)
DN: D1.6(I/O1) U1.26(IO18)
DN_IN: D1.1(I/O1) USB2.2(D-)
DP: D1.4(I/O2) U1.27(IO19)
DP_IN: D1.3(I/O2) USB2.3(D+)
MODE_BUTTON: C19.2 SW4.2 U1.19(IO5)
MOTOR1_IN1: U1.13(IO1) U37.3(IN1)
MOTOR1_IN2: U1.6(IO3) U37.2(IN2)
MOTOR1_OUT1: P1.1 U37.6(OUT1)
MOTOR1_OUT2: P1.2 U37.8(OUT2)
MOTOR2_IN1: U1.20(IO6) U38.3(IN1)
MOTOR2_IN2: U1.21(IO7) U38.2(IN2)
MOTOR2_OUT1: P2.1 U38.6(OUT1)
MOTOR2_OUT2: P2.2 U38.8(OUT2)
RESET: C3.2 C5.2 R2.1 U1.8(EN) U2.1
RX: H2.3 U1.30(RXD0)
SERVO1: CN3.1 U1.18(IO4)
SERVO2: CN4.1 R3.2 U1.22(IO8)
TX: H2.1 U1.31(TXD0)
USB_VIN: D1.5(VBUS) D8.2(A) H2.4 USB2.1(VCC)
V_IN: C11.2 C15.2 C16.2 C17.2 C18.2 D8.1(K) LED3.2(A) R12.2 U35.3(INPUT) U36.2 U37.5(VM) U38.5(VM) U39.2 U40.2
$2N3486: H1.1 R1.1 U1.5(IO2)
$2N6315: LED1.2(+) R4.1
$3N8423: R13.2 U37.7(ISEN)
$3N8940: R14.2 U38.7(ISEN)
$5N508: Q8.1(G) R9.2
$5N509: LED3.1(K) R10.2

Not connected (* = marked no-connect by the designer): CN2 3* 4*; U1 4(NC)* 7(NC)* 9(NC)* 10(NC)* 15(NC)* 17(NC)* 24(NC)* 25(NC)* 28(NC)* 29(NC)* 32(NC)* 33(NC)* 34(NC)* 35(NC)*; U39 3* 4*; U40 3* 4*; USB2 6(EH)*

## Notes on the sheets
sheet 2
- USB Boot and Reset
- GPIO2 can be used as a spare
  Must be pulled HIGH at Bootup
- Internally Pulled High On Boot
- Pulled HIGH near Board
- USB-Micro Connection
- ESD Suppression
- UART Connection
sheet 3
- 3.3V Power Regulation
- Motor Drivers
- 15V Input Max
  30 deg C / Watt
- Current Shutoff at 2.2Amp
  Voltage Input: 6.5V to 30V
- Battery Measurement
- 100mW 0.1% Accuracy
sheet 4
- Power Protection
- Short Circuit
- Reverse Polarity
  Protection
- Power Muxing
- ESD Protection
- POWER ON LED

# Board PCB1_1
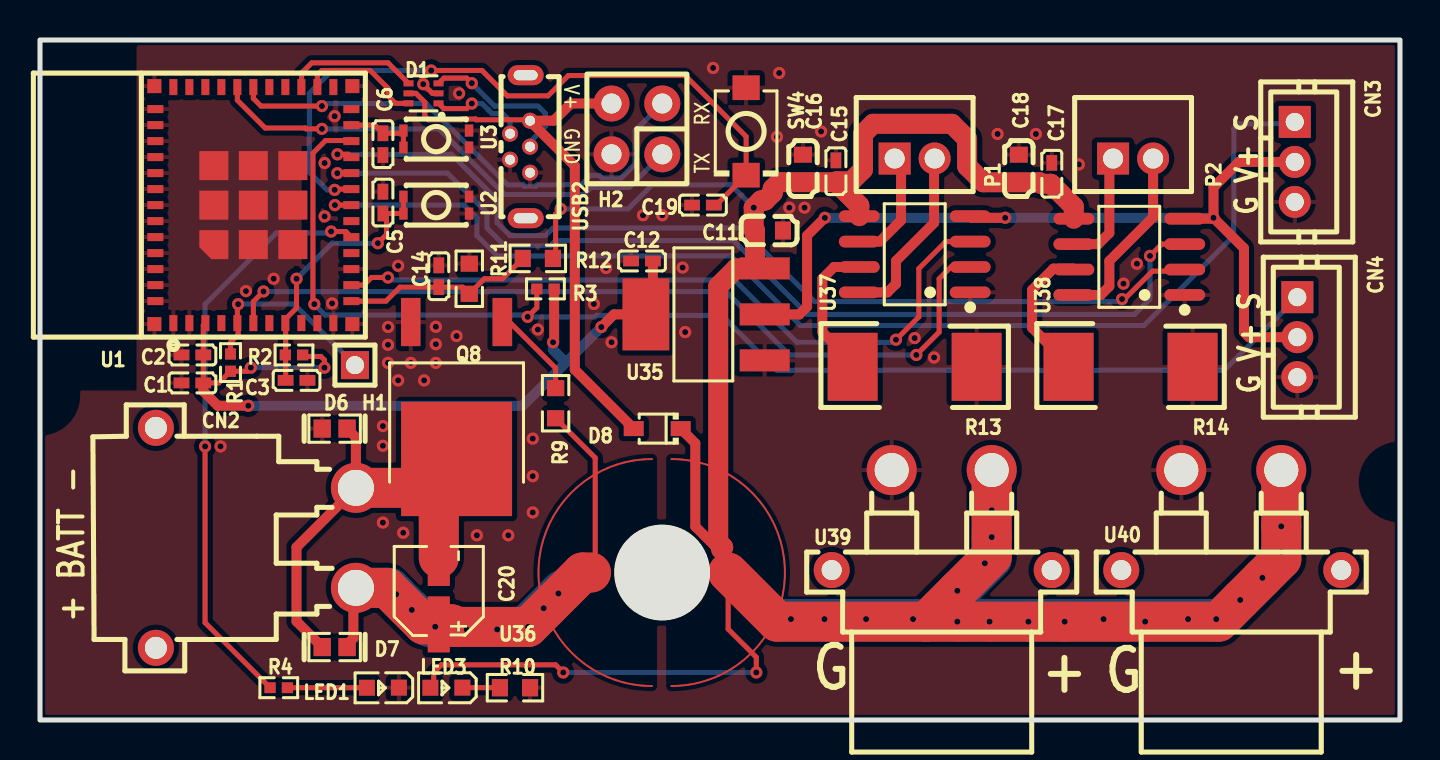
[diagram p4: board, top side]
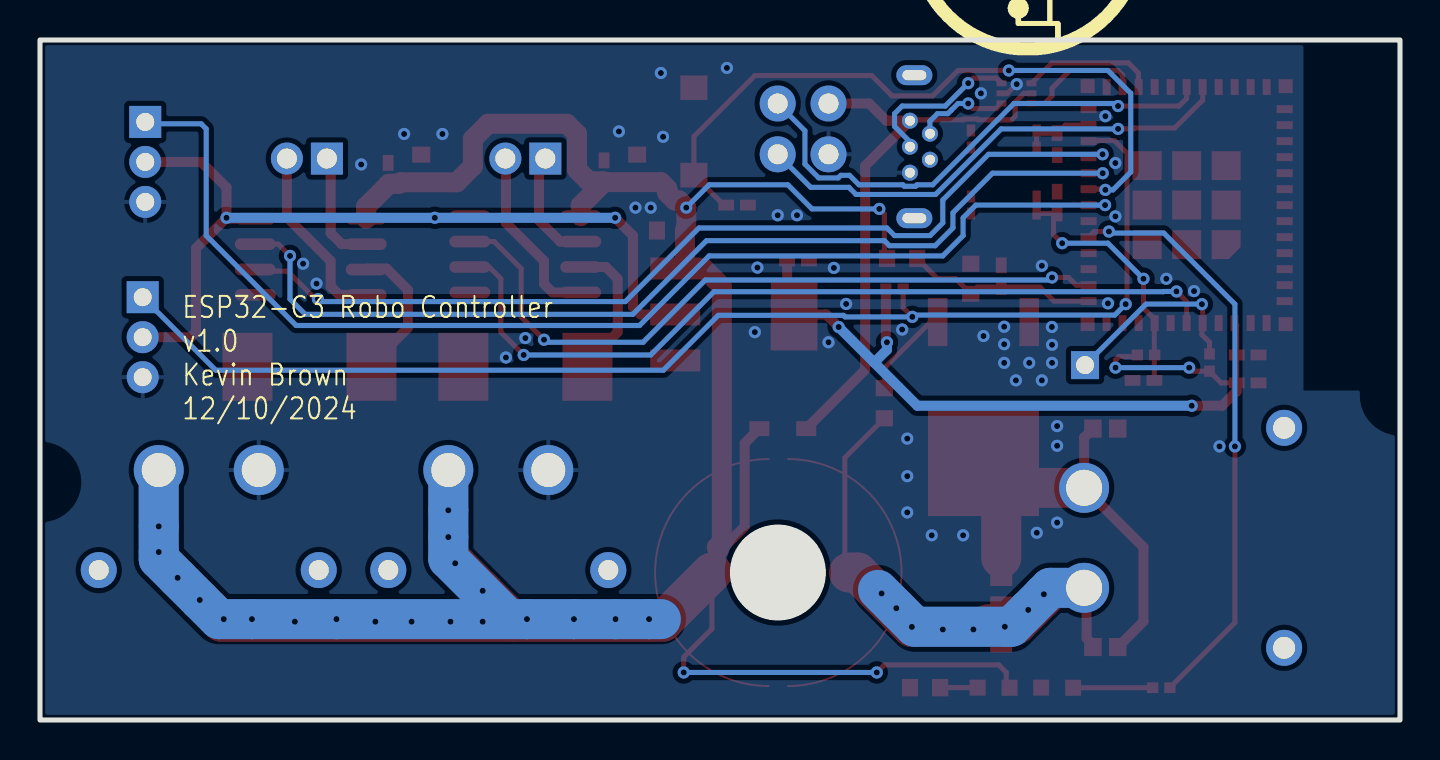
[diagram p5: board, bottom side, seen from below]

Outline 68 x 34 mm; copper layers: Top Layer, Inner1, Inner2, Bottom Layer. Coordinates in mm from the lower left corner of the outline.
Outline path: rectangle 0,34 68,0
Stack: Top Layer 0.035mm Outer layer copper thickness 1oz / Dielectric1 0.2104mm 7628 RC49% 8.6mil / Inner1 0.0152mm Inner layer copper thickness / Dielectric2 1.065mm 1.1mm H/HOZ Copper / Inner2 0.0152mm Inner layer copper thickness / Dielectric3 0.2104mm 7628 RC49% 8.6mil / Bottom Layer 0.035mm Outer layer copper thickness 1oz

## Design rules (mm)
template: JLCPCB Capability(Two Layers Board)
spacing copperThickness1oz (default): track to track 0.102, other pairs 0.152 to 0.3
spacing copperThickness2oz: track to track 0.203, other pairs 0.152 to 0.3
track width copperThickness1oz (default): min 0.127, default 0.254, max 2.54
track width copperThickness2oz: min 0.203, default 0.254, max 2.54
differential pair differentialPair (default): width min 0.127, default 0.254, max 2.54; gap min 0.152, default 0.152
via viaSize (default): diameter min 0.5, default 0.61, max 10; hole min 0.3, default 0.305, max 6.3

## Placement (name value [footprint] x y rotation side)
C1  10uF  [C0402]  7.62 16.85 0 top
C2  100nF  [C0402]  7.62 18.25 0 top
C3  1uF  [C0402]  12.83 16.98 180 top
C5  100nF  [C0402]  17.14 25.87 270 top
C6  100nF  [C0402]  17.14 28.79 90 top
C11  10uF  [C0603]  36.45 24.47 180 top
C12  22uF  [C0402]  30.1 22.95 0 top
C14  47nF  [C0402]  19.94 22.19 270 top
C15  100nF  [C0402]  39.8 27.44 270 top
C16  10uF  [C0603]  38.14 27.57 270 top
C17  100nF  [C0402]  50.59 27.31 270 top
C18  10uF  [C0603]  48.94 27.57 270 top
C19  1uF  [C0402]  33.15 25.74 0 top
C20  10uF  [CAP-SMD_BD4.0-L4.3-W4.3-FD]  19.94 6.44 90 top
CN2  XT30PW-M30.G.Y  [CONN-TH_XT30PW-M]  10.8 9.11 270 top
CN3  SERVO1  [CONN-TH_3P-P2.00_PH-3AK]  62.74 27.9 270 top
CN4  SERVO2  [CONN-TH_3P-P2.00_PH-3AK]  62.87 19.14 270 top
D1  USBLC6-2P6_C2827693  [SOT-666-6_L1.6-W1.2-P0.50-LS1.6-BL]  19.18 31.33 90 top
D6  ESDA05  [D0603-BI]  14.73 14.57 0 top
D7  ESDA05  [D0603-BI]  14.73 3.65 0 top
D8  B5819WS_C22624  [SOD-323_L1.8-W1.3-LS2.5-RD]  30.86 14.57 180 top
H1  -  [HDR-TH_1P-V-M_XKB_X4611WV-01I-C28D40]  15.75 17.74 0 top
H2  -  [HDR-TH_4P-P2.54-V-F-R2-C2-S2.54]  29.84 29.55 90 top
LED1  NCD0603B1  [LED0603-RD]  17.14 1.61 180 top
LED3  NCD0603G1  [LED0603-RD]  20.32 1.61 180 top
P1  MOTOR1  [CONN-TH_2P-P2.00_PH-2A_C2319]  43.73 28.07 180 top
P2  MOTOR2  [CONN-TH_2P-P2.00_PH-2A_C2319]  54.65 28.07 180 top
Q8  IRLR8726TRPBF  [TO-252-2_L6.6-W6.1-P4.58-LS9.9-TL]  20.83 16.47 270 top
R1  10kΩ  [R0402]  9.53 17.87 270 top
R2  10kΩ  [R0402]  12.7 18.25 0 top
R3  10kΩ  [R0402]  25.27 21.55 180 top
R4  1kΩ  [R0402]  11.94 1.61 180 top
R9  10kΩ  [R0603]  25.78 15.84 90 top
R10  1kΩ  [R0603]  23.75 1.61 180 top
R11  10kΩ  [R0603]  21.46 22.06 270 top
R12  27kΩ  [R0603]  24.89 23.08 0 top
R13  150mΩ  [RES-SMD_L6.4-W3.2-1]  43.73 17.66 180 top
R14  150mΩ  [RES-SMD_L6.4-W3.2-1]  54.53 17.66 180 top
SW4  TS-1088-AR02016  [SW-SMD_L3.9-W3.0-P4.45]  35.31 29.43 270 top
U1  2.4GHz  [WIFIM-SMD_ESP32-C3-MINI-1]  10.67 25.74 90 top
U2  RESET  [SW-SMD_4P-L3.0-W2.0-P0.85-LS3.5]  19.81 25.74 0 top
U3  BOOT  [SW-SMD_4P-L3.0-W2.0-P0.85-LS3.5]  19.81 29.05 0 top
U35  AZ1117H-3.3TRG1  [SOT-223-3_L6.5-W3.4-P2.30-LS7.0-BR]  33.27 20.28 0 top
U36  -  [screw_switch]  31.11 7.37 0 top
U37  HX8870-S  [SOIC-8_L4.9-W3.9-P1.27-LS6.0-BL]  43.74 23.29 90 top
U38  HX8870-S  [SOIC-8_L4.9-W3.9-P1.27-LS6.0-BL]  54.46 23.16 90 top
U39  PWR1  [CONN-TH_XT30PW-F-1]  45.09 10 0 top
U40  PWR2  [CONN-TH_XT30PW-F-1]  59.56 10 0 top
USB2  MICRO 180°JB  [MINI-USB-SMD_U255-051N-4BH70-XS]  24 28.67 90 top

## Footprints (pads in the part's own frame, mm; a bottom-side part is the same pattern mirrored in y, then rotated)
C0402
  rect 0.79x0.54 smd: 1(-0.545,0) 2(0.545,0)
C0603
  rect 0.8x0.9 smd: 1(-0.7,0) 2(0.7,0)
CAP-SMD_BD4.0-L4.3-W4.3-FD
  rect 2.8x1.1 smd: 1(-1.661,0) 2(1.661,0)
CONN-TH_2P-P2.00_PH-2A_C2319
  rect 1.6x1.6 hole 1: 1(1,0)
  round 1.6 hole 1: 2(-1,0)
CONN-TH_3P-P2.00_PH-3AK
  rect 1.6x1.6 hole 0.9: 1(-2,0)
  round 1.6 hole 0.9: 2(0,0) 3(2,0)
CONN-TH_XT30PW-F-1
  round 2.5 hole 1.7: 1(-2.5,2.5) 2(2.5,2.5)
  round 1.8 hole 1: 3(5.5,-2.5) 4(-5.5,-2.5)
CONN-TH_XT30PW-M
  round 2.5 hole 1.8: 1(-2.5,5) 2(2.5,5)
  round 1.8 hole 1.1: 3(5.5,-5) 4(-5.5,-5)
D0603-BI
  rect 0.873x0.907 smd: 1(-0.622,0) 2(0.622,0)
HDR-TH_1P-V-M_XKB_X4611WV-01I-C28D40
  rect 1.4x1.4 hole 0.9: 1(0,0)
HDR-TH_4P-P2.54-V-F-R2-C2-S2.54
  round 1.8 hole 1: 1(-1.27,-1.27) 2(-1.27,1.27) 3(1.27,-1.27) 4(1.27,1.27)
LED0603-RD
  rect 0.8x0.8 smd: 1(-0.799,-0.004) 2(0.799,0.004)
MINI-USB-SMD_U255-051N-4BH70-XS
  round 0.8 hole 0.5: 1(1.3,-0.5) 2(0.65,0.5) 3(0,-0.5) 4(-0.65,0.5) 5(-1.3,-0.5)
  oval 1x1.8 hole 0.5x1.2: 6(-3.575,-0.28) 6(3.575,-0.28)
R0402
  rect 0.566x0.54 smd: 1(-0.433,0) 2(0.433,0)
R0603
  rect 0.806x0.864 smd: 1(-0.753,0) 2(0.753,0)
RES-SMD_L6.4-W3.2-1
  rect 2.5x3.4 smd: 1(-3.1,0) 2(3.1,0)
screw_switch
  custom 5.674x11.348 smd: 1(-3.345,0) 2(3.302,0)
SOD-323_L1.8-W1.3-LS2.5-RD
  rect 1x0.75 smd: 1(-1.173,0) 2(1.173,0)
SOIC-8_L4.9-W3.9-P1.27-LS6.0-BL
  oval 0.588x2.045 smd: 1(-1.905,-2.772) 2(-0.635,-2.772) 3(0.635,-2.772) 4(1.905,-2.772) 5(1.905,2.772) 6(0.635,2.772) 7(-0.635,2.772) 8(-1.905,2.772)
SOT-223-3_L6.5-W3.4-P2.30-LS7.0-BR
  rect 2.5x1.1 smd: 1(2.97,-2.3) 2(2.97,0) 3(2.97,2.3)
  rect 2.34x3.6 smd: 4(-2.97,0)
SOT-666-6_L1.6-W1.2-P0.50-LS1.6-BL
  rect 0.3x0.5 smd: 1(-0.5,-0.75) 2(-0.001,-0.75) 3(0.5,-0.75) 4(0.5,0.75) 5(0,0.75) 6(-0.5,0.75)
SW-SMD_4P-L3.0-W2.0-P0.85-LS3.5
  rect 0.42x0.6 smd: 1(-1.64,0.425) 1(-1.64,-0.425) 2(1.64,0.425) 2(1.64,-0.425)
SW-SMD_L3.9-W3.0-P4.45
  rect 1.23x1.36 smd: 1(-2.185,0) 2(2.185,0)
TO-252-2_L6.6-W6.1-P4.58-LS9.9-TL
  rect 2.409x0.979 smd: 1(-3.424,2.29) 3(-3.424,-2.29)
  rect 5.711x5.548 smd: 2(3.424,0)
WIFIM-SMD_ESP32-C3-MINI-1
  rect 0.8x0.4 smd: 1(-5.9,4) 2(-5.9,3.2) 3(-5.9,2.4) 4(-5.9,1.6) 5(-5.9,0.8) 6(-5.9,0) 7(-5.9,-0.8) 8(-5.9,-1.6) 9(-5.9,-2.4) 10(-5.9,-3.2) 11(-5.9,-4) 25(5.9,-4) 26(5.9,-3.2) 27(5.9,-2.4) 28(5.9,-1.6) 29(5.9,-0.8) 30(5.9,0) 31(5.9,0.8) 32(5.9,1.6) 33(5.9,2.4) 34(5.9,3.2) 35(5.9,4)
  rect 0.4x0.8 smd: 12(-4.8,-4.9) 13(-4,-4.9) 14(-3.2,-4.9) 15(-2.4,-4.9) 16(-1.6,-4.9) 17(-0.8,-4.9) 18(0,-4.9) 19(0.8,-4.9) 20(1.6,-4.9) 21(2.4,-4.9) 22(3.2,-4.9) 23(4,-4.9) 24(4.8,-4.9) 36(4.8,4.9) 37(4,4.9) 38(3.2,4.9) 39(2.4,4.9) 40(1.6,4.9) 41(0.8,4.9) 42(0,4.9) 43(-0.8,4.9) 44(-1.6,4.9) 45(-2.4,4.9) 46(-3.2,4.9) 47(-4,4.9) 48(-4.8,4.9)
  custom 1.45x1.45 smd: 49(-1.975,1.975)
  rect 1.45x1.45 smd: 49(-1.975,0) 49(-1.975,-1.975) 49(0,1.975) 49(0,0) 49(0,-1.975) 49(1.975,1.975) 49(1.975,0) 49(1.975,-1.975)
  rect 0.7x0.7 smd: 50(5.95,4.95) 51(5.95,-4.95) 52(-5.95,-4.95) 53(-5.95,4.95)

## Nets
As in the schematic.

Pads without a net: CN2 3 4; U1 4 7 9 10 15 17 24 25 28 29 32 33 34 35; U39 3 4; U40 3 4; USB2 6

## Via types
v1: diameter 0.61, hole 0.305, Top Layer to Bottom Layer, 112 vias

## Routing (per net, layer and track width the routed paths; a pad name or vN(x,y) marks a point on that pad's centre or on a via; arc(x,y) is an arc through that point)
3V3: length 87.5
  Top Layer w0.254: v1(14.22,17.62) 14.22,18 14.04,18.18 13.21,18.18 13.13,18.25 ; U1.3 8.17,19.74 C2.2 C1.2 8.94,16.85 R1.2 10.36,17.44 v1(10.54,17.62)
  Top Layer w0.5: v1(25.65,18.89) 25.71,18.94 R3.1 ; v1(28.07,19.65) 28.7,20.28 U35.4 30.64,20.63 C12.2 ; CN3.2 59.94,27.9 58.67,26.63 v1(58.67,25.11) ; v1(48.26,25.11) 46.59,25.11 U37.4 ; v1(58.67,25.11) 58.63,25.06 U38.4 ; v1(58.67,25.11) 60.2,23.59 60.2,19.39 60.45,19.14 CN4.2 ; C1.2 8.17,16.44 8.89,15.71 v1(10.41,15.71) ; v1(39.24,25.11) 38.35,24.22 38.35,20.66 37.97,20.28 U35.2
  Bottom Layer w0.254: v1(10.54,17.62) v1(14.22,17.62)
  Bottom Layer w0.5: 26.29,17.87 25.65,18.51 v1(25.65,18.89) ; 26.29,17.87 v1(28.07,19.65) ; 26.29,17.87 24.13,15.71 v1(10.41,15.71) ; v1(39.24,25.11) v1(48.26,25.11) v1(58.67,25.11)
GND: length 1
  Top Layer w0.254: D1.2 19.62,31.33 v1(19.16,31.79)
  vias: v1(9.03,13.68) v1(10.3,21.45) v1(11.68,22.06) v1(14.23,27.85) v1(14.23,25.18) v1(14.61,20.83) v1(14.73,30.19) v1(17.14,14.7) v1(17.14,13.71) v1(17.14,9.87) v1(17.41,19.65) v1(17.4,18.76) v1(17.4,17.86) v1(17.91,22.71) v1(17.91,16.98) v1(18.16,9.36) v1(18.54,17.86) v1(19.21,16.98) v1(19.79,19.66) v1(19.79,18.79) v1(19.79,17.86) v1(20.83,19.2) v1(20.96,31.33) v1(21.84,9.23) v1(23.41,9.23) v1(24.64,14.07) v1(24.64,12.19) v1(24.64,10.38) v1(24.89,19.52) v1(27.69,20.8) v1(28.31,22.6) v1(28.57,18.89) v1(30.15,25.24) v1(31.12,25.24) v1(32.13,22.62) v1(32.26,19.39) v1(33.66,32.6) v1(36.85,29.16) v1(36.96,32.35) v1(37.47,25.62) v1(38.23,25.62) v1(39.05,29.43) v1(43.73,19.1) v1(44.7,18.12) v1(47.88,29.3) v1(49.8,29.3) v1(51.94,27.78) v1(54.17,21.82) v1(54.85,22.81)
BATT_GND: length 22.6
  Top Layer w0.5: D7.1 12.83,4.93 12.83,8.64 CN2.1 15.8,14.13 D6.2
  Top Layer w2: CN2.1 19.39,11.61 19.94,12.16 ; C20.2 19.94,12.16 ; 19.94,12.16 20.83,13.05
BATT_IN: length 37.2
  Top Layer w0.254: U36.1 27.76,13.11 R9.1
  Top Layer w0.5: D7.2 15.35,3.77 15.67,4.09 15.67,6.48 CN2.2
  Top Layer w2: 27.55,7.37 27.13,7.37 v1(24.41,4.65) 20.71,4.65 20.58,4.78 C20.1 19.18,4.78 17.35,6.61 CN2.2
  Bottom Layer w2: CN2.2 17.49,6.61 v1(17.81,6.29) v1(18.59,5.5) 19.43,4.66 v1(19.76,4.66) 24.26,4.66 v1(25.18,5.59) 26.1,6.5
  vias: v1(21.33,4.53) v1(22.86,4.53) v1(25.92,6.33)
BATT_MEAS: length 9.7
  Top Layer w0.254: R12.1 23.12,22.06 22.22,22.06 R11.2 21.13,21.64 C14.2 18,21.64 17.3,20.94 U1.12
BOOT: length 3.7
  Top Layer w0.254: U1.23 16.74,29.74 C6.2 18.04,29.34 U3.1 U3.1
DEBUG_LED: length 29.5
  Top Layer w0.254: R4.2 8.25,4.86 v1(8.25,13.68) ; v1(14.55,24.42) 15.29,24.42 U1.16
  Bottom Layer w0.254: v1(14.55,24.42) 14.48,24.35 11.81,24.35 8.25,20.79 v1(8.25,13.68)
DN: length 6.2
  Top Layer w0.254: U1.26 13.87,32.25 14.1,32.48 16.51,32.48 17.4,31.59 17.4,31.21 17.77,30.83 D1.6
DN_IN: length 4.8
  Top Layer w0.254: D1.1 20.19,30.57 21.34,30.57 v1(21.59,30.82)
  Bottom Layer w0.254: USB2.2 23.5,29.94 23.13,30.32 22.61,30.32 22.43,30.5 22.43,30.5 22.1,30.82 v1(21.59,30.82)
DP: length 6.7
  Top Layer w0.254: U1.27 13.08,31.66 13.08,32.35 13.59,32.86 17.4,32.86 D1.4
DP_IN: length 8.2
  Top Layer w0.254: v1(21.59,31.84) 21.34,32.09 20.19,32.09 D1.3
  Bottom Layer w0.254: USB2.3 24.5,28.91 25.27,29.68 25.27,30.32 24.89,30.7 22.73,30.7 v1(21.59,31.84)
MODE_BUTTON: length 35.1
  Top Layer w0.254: v1(19.56,32.48) 22.1,32.48 23.37,31.21 25.4,31.21 26.42,32.22 32.26,32.22 35.31,29.17 SW4.2 33.81,25.74 C19.2 ; v1(14.73,26.51) 14.77,26.55 U1.19
  Bottom Layer w0.254: v1(19.56,32.48) 14.61,32.48 13.46,31.33 13.46,27.4 14.35,26.51 v1(14.73,26.51)
MOTOR1_IN1: length 35.9
  Top Layer w0.254: v1(42.8,19.01) 43.94,20.16 43.94,22.57 45.29,23.92 U37.3 ; v1(17.4,22.13) 16.57,22.13 16.19,21.74 U1.13
  Bottom Layer w0.254: v1(42.8,19.01) 42.67,18.89 37.85,18.89 34.73,22 17.53,22 v1(17.4,22.13)
MOTOR1_IN2: length 41.8
  Top Layer w0.254: U1.6 10.67,20.92 v1(11.18,21.43) ; U37.2 45.55,22.65 44.96,22.06 44.96,19.39 v1(43.81,18.25)
  Bottom Layer w0.254: v1(43.81,18.25) 37.47,18.25 34.3,21.41 11.82,21.41 11.81,21.43 v1(11.18,21.43)
MOTOR1_OUT1: length 5.8
  Top Layer w0.5: U37.6 41.99,23.92 43.05,24.98 43.05,27.75 P1.1
MOTOR1_OUT2: length 9.1
  Top Layer w0.5: P1.2 44.7,28.04 44.7,24.86 42.8,22.95 42.8,21.81 42.37,21.38 U37.8
MOTOR2_IN1: length 49.4
  Top Layer w0.254: U38.3 56.09,23.79 v1(55.5,23.2) ; U1.20 15.56,27.34 v1(14.86,27.34)
  Bottom Layer w0.254: v1(14.86,27.34) 20.38,27.34 22.35,25.36 22.35,24.6 23.24,23.71 25.53,23.71 25.78,23.97 34.68,23.97 38.36,20.28 54.74,20.28 55.5,21.05 v1(55.5,23.2)
MOTOR2_IN2: length 47.8
  Top Layer w0.254: v1(14.87,28.28) 15.43,28.28 U1.21 ; v1(54.1,21.05) 54.23,21.05 55.63,22.44 57.16,22.44 U38.2
  Bottom Layer w0.254: v1(14.87,28.28) 20.57,28.28 22.86,26 22.86,24.86 23.5,24.22 25.27,24.22 25.65,24.6 35.05,24.6 38.74,20.92 53.97,20.92 v1(54.1,21.05)
MOTOR2_OUT1: length 5.8
  Top Layer w0.5: P2.1 53.47,27.89 53.47,24.35 52.91,23.79 U38.6
MOTOR2_OUT2: length 9.3
  Top Layer w0.5: U38.8 53.04,21.25 53.47,21.68 53.47,22.95 55.65,25.14 P2.2
RESET: length 13.7
  Top Layer w0.254: v1(12.83,22.06) 12.83,20.6 12.27,20.04 U1.8 12.28,19.83 C3.2 ; v1(16.89,23.84) 17.32,24.27 17.32,25.15 C5.2 18.16,25.33 U2.1 18.17,26.17
  Bottom Layer w0.254: v1(16.89,23.84) 14.61,23.84 v1(12.83,22.06)
RX: length 25.7
  Top Layer w0.254: v1(14.1,30.7) 11.05,30.7 10.67,31.08 U1.30
  Bottom Layer w0.254: v1(14.1,30.7) 14.22,30.82 19.3,30.82 23.37,26.76 24.15,26.76 24.22,26.69 24.78,26.69 24.86,26.76 27.05,26.76 27.52,27.23 27.96,27.23 28.09,27.11 29.06,27.11 29.75,27.8 29.75,29.46 H2.3
SERVO1: length 59.2
  Top Layer w0.254: U1.18 v1(14.75,25.74)
  Bottom Layer w0.254: CN3.1 62.64,29.81 59.94,29.81 59.69,29.55 59.69,24.22 55.19,19.72 38.02,19.72 34.54,23.2 22.86,23.2 21.84,24.22 21.84,25.11 21.21,25.74 v1(14.75,25.74)
SERVO2: length 63.5
  Top Layer w0.254: v1(24.38,20.16) 24.84,20.61 R3.2 ; v1(13.72,20.79) 13.65,20.86 13.65,28.34 14.28,28.97 15.54,28.97 U1.22
  Bottom Layer w0.254: CN4.1 59.21,17.49 36.83,17.49 34.09,20.23 27.82,20.23 27.75,20.16 v1(24.38,20.16) 24.29,20.25 14.26,20.25 v1(13.72,20.79)
TX: length 24.7
  Top Layer w0.254: v1(14.1,29.56) 13.3,29.56 13.26,29.6 11.26,29.6 9.87,30.99 U1.31
  Bottom Layer w0.254: v1(14.1,29.56) 19.94,29.56 23.22,26.28 27.2,26.28 27.55,26.63 29.46,26.63 H2.1
USB_VIN: length 29
  Top Layer w0.254: 24.46,30.01 21.82,30.01 21.78,30.05 21.13,30.05 21.09,30.01 19.42,30.01 19.24,30.19 19.24,30.89 18.8,31.33 D1.5
  Top Layer w0.5: 24.5,29.94 26.74,27.71 26.74,17.52 D8.2 ; USB2.1 25.68,29.97 26.54,30.82 H2.4
V_IN: length 169
  Top Layer w0.254: U36.2 34.41,4.55 35.81,3.14 v1(35.81,2.38) ; v1(26.03,25.55) 25.78,25.3 25.78,23.21 R12.2 ; LED3.2 19.69,1.78 19.69,2.38 20.07,2.76 25.78,2.76 v1(26.16,2.38)
  Top Layer w0.5: D8.1 32.77,13.84 32.77,9.67 33.91,8.53 34.05,8.53 ; 35.75,23.07 U35.3
  Top Layer w1: U38.5 51.69,25.67 C17.2 50.55,26.81 50.05,26.81 49.97,26.89 47.16,26.89 46.35,27.69 46.35,29.05 45.59,29.81 41.66,29.81 41.15,29.3 41.15,27.52 40.56,26.94 39.84,26.94 C15.2 ; 35.75,23.07 35.75,24.47 35.69,24.54 v1(35.69,25.62) 36.04,25.98 36.26,25.98 36.64,26.36 36.64,26.57 36.96,26.89 C15.2 ; C15.2 40.96,25.72 U37.5 ; U35.3 34.81,22.58 33.91,21.68 33.91,8.89 34.16,8.64 34.05,8.53
  Top Layer w2: U40.2 v1(62.06,9.68) v1(62.06,8.4) 62.06,8.05 v1(61.12,7.11) v1(60.01,6) 58.93,4.92 v1(55.26,4.92) v1(51.23,4.92) v1(49.42,4.92) v1(47.48,4.92) v1(45.87,4.92) 44.32,4.92 ; U39.2 v1(47.59,10.49) v1(47.59,9.14) 47.59,8.18 v1(47.24,7.84) v1(45.87,6.46) 44.32,4.92 ; U36.2 36.86,4.92 44.32,4.92
  Bottom Layer w0.254: v1(26.03,25.55) 29.4,25.55 30.61,26.76 34.54,26.76 v1(35.69,25.62) ; v1(26.16,2.38) v1(35.81,2.38)
  Bottom Layer w2: U39.2 v1(47.59,10.49) v1(47.59,9.14) 47.59,8.05 44.83,5.3 ; 36.96,5.04 v1(37.55,5.04) v1(39.22,5.04) v1(41.3,5.04) v1(43.65,5.04) v1(53.18,5.04) v1(57.4,5.04) 59.06,5.04 v1(60.01,6) v1(61.12,7.11) 62.06,8.05 v1(62.06,8.4) v1(62.06,9.68) U40.2
  vias: v1(58.81,5.04)
$2N3486: length 9.8
  Top Layer w0.254: v1(9.91,20.79) 9.87,20.75 U1.5 9.91,19.81 9.91,19.27 9.53,18.89 R1.1
  Bottom Layer w0.254: H1.1 12.7,20.79 v1(9.91,20.79)
$2N6315: length 4
  Top Layer w0.254: R4.1 16.34,1.61 LED1.2
$3N8423: length 7.1
  Top Layer w0.5: U37.7 39.71,22.65 39.12,22.06 39.12,19.39 40.63,17.88 R13.2
$3N8940: length 7.1
  Top Layer w0.5: U38.7 51.65,22.57 50.67,22.57 49.6,21.5 49.6,19.61 51.43,17.79 R14.2
$5N508: length 4.6
  Top Layer w0.254: Q8.1 23.48,19.9 25.78,17.59 R9.2
$5N509: length 1.9
  Top Layer w0.254: LED3.1 22.99,1.62 R10.2

## Copper pours and planes (outline as drawn; the poured copper is in the pictures)
GND on Top Layer: 7.49,29.17 13.08,29.17 13.08,22.7 7.49,22.7
GND on Top Layer: -2.67,36.54 70.74,36.54 70.74,-3.34 -2.67,-3.34
GND on Bottom Layer: -4.95,38.19 73.15,38.19 73.15,-5.88 -4.95,-5.88
GND on Inner1: 0.26,33.74 67.74,33.74 67.74,0.26 0.26,0.26
GND on Inner2: 0.26,33.74 67.74,33.74 67.74,0.26 0.26,0.26

Small or netless copper shapes (teardrops, artwork), in the pictures only: 23 on Inner1, 23 on Inner2

## Text on the board
Bottom Silkscreen Layer: ESP32-C3 Robo Controller / v1.0 / Kevin Brown / 12/10/2024
Top Silkscreen Layer: TX   RX | V+  GND | G V+ S | + BATT - | G | +
